# EAGLE design fx3 (EAGLE 9.6.2)
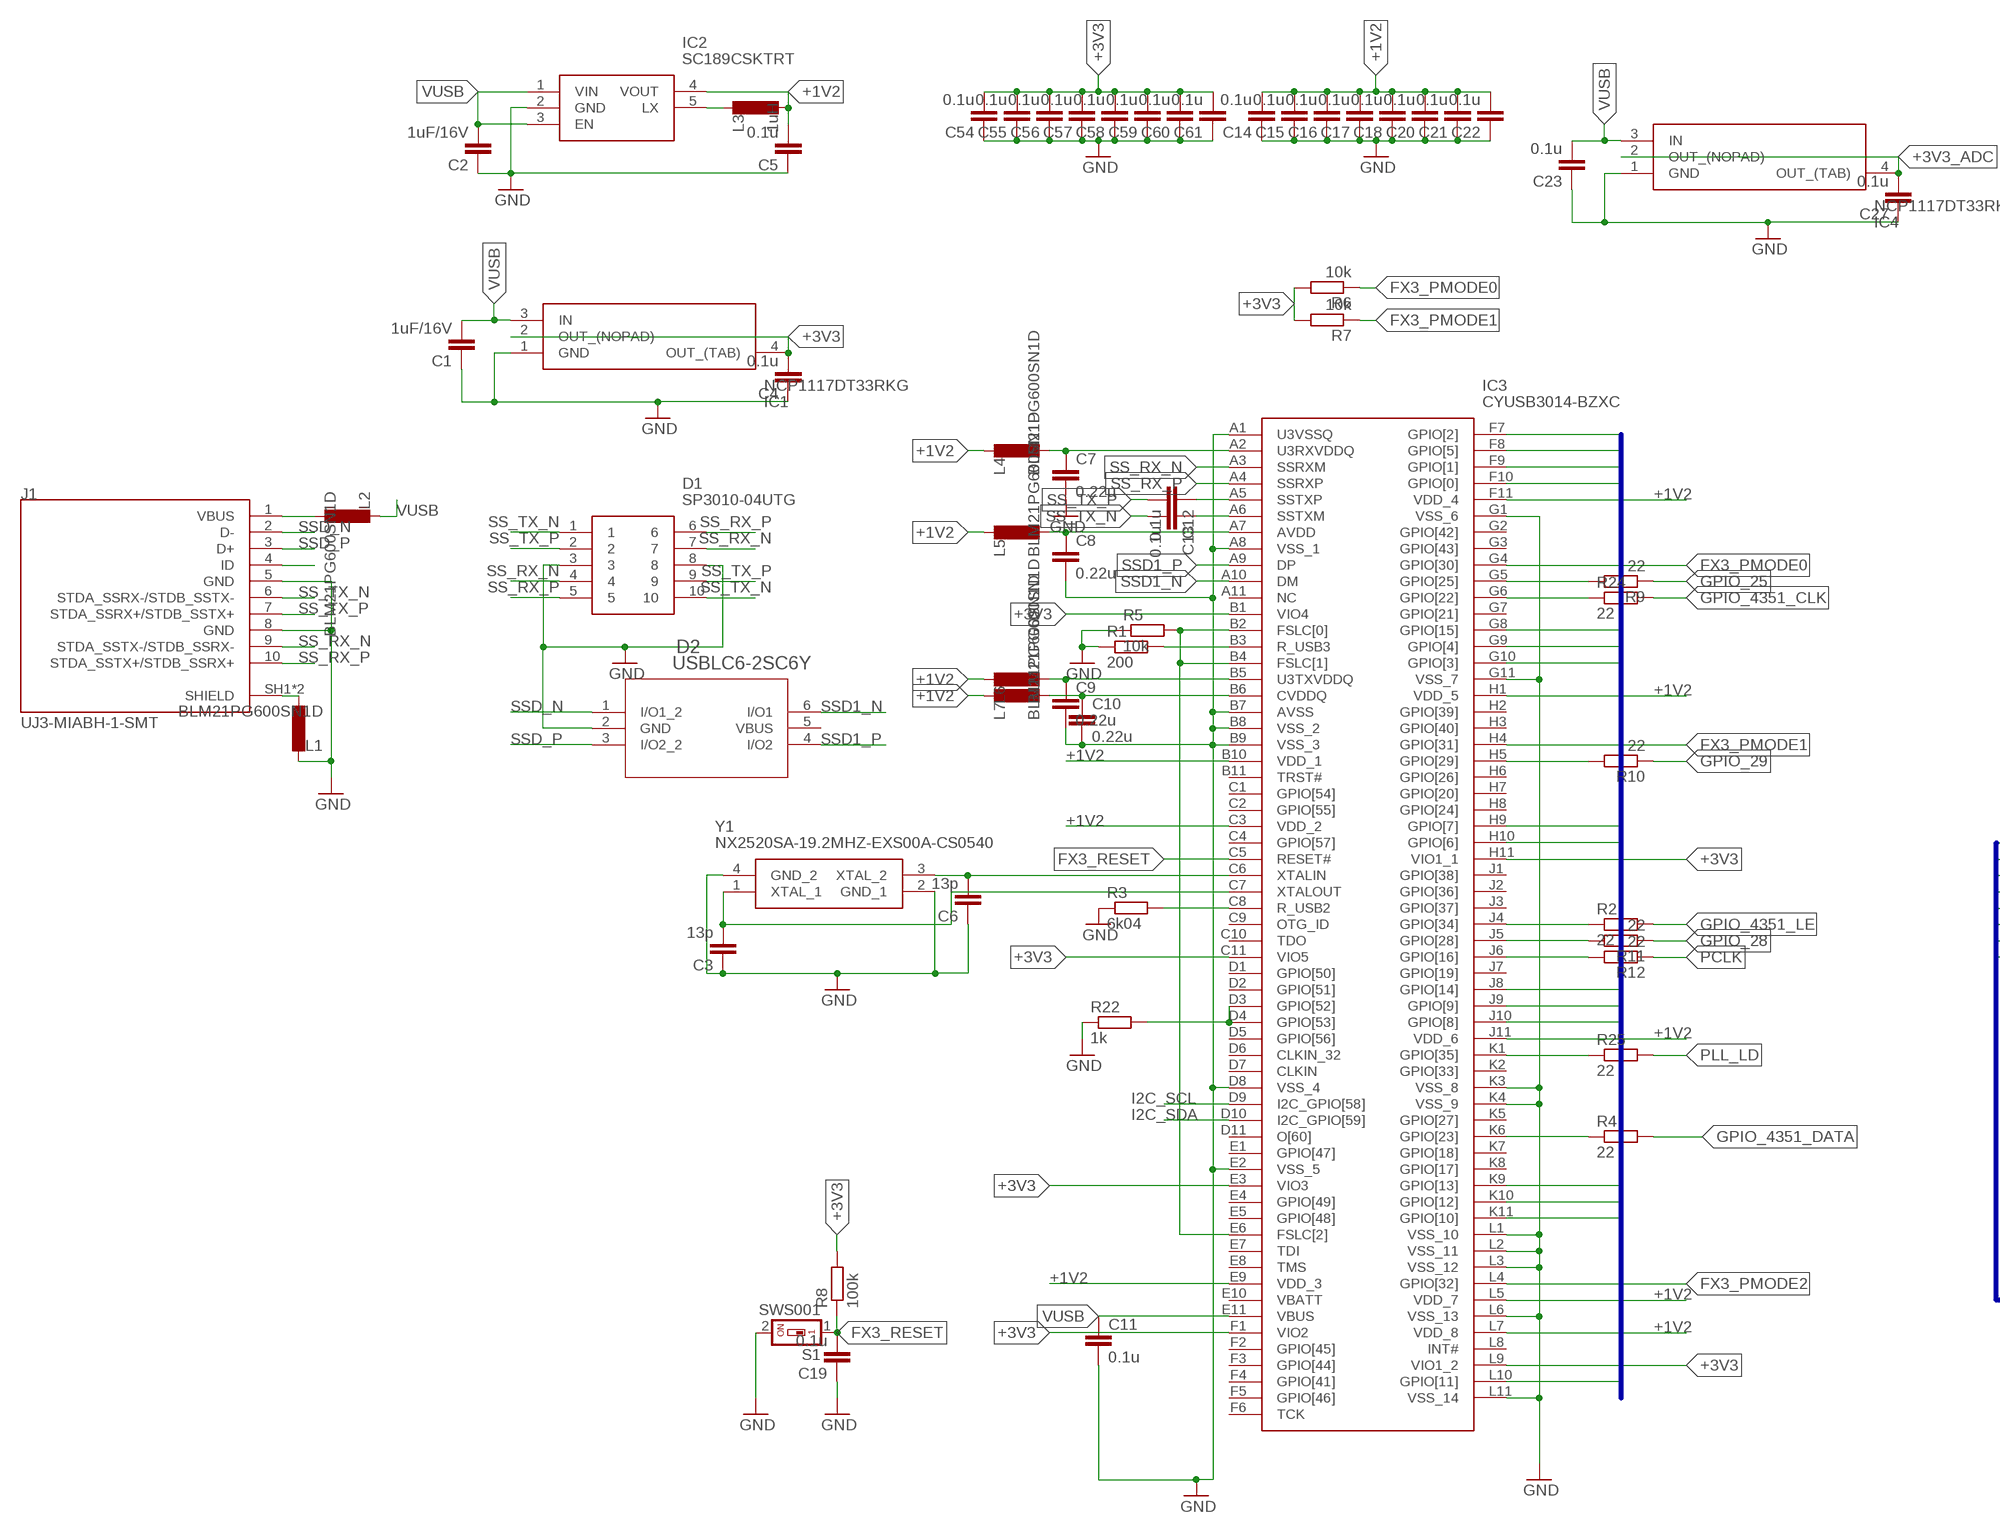
[diagram p0: schematic, sheet 1, part 1 of 2]
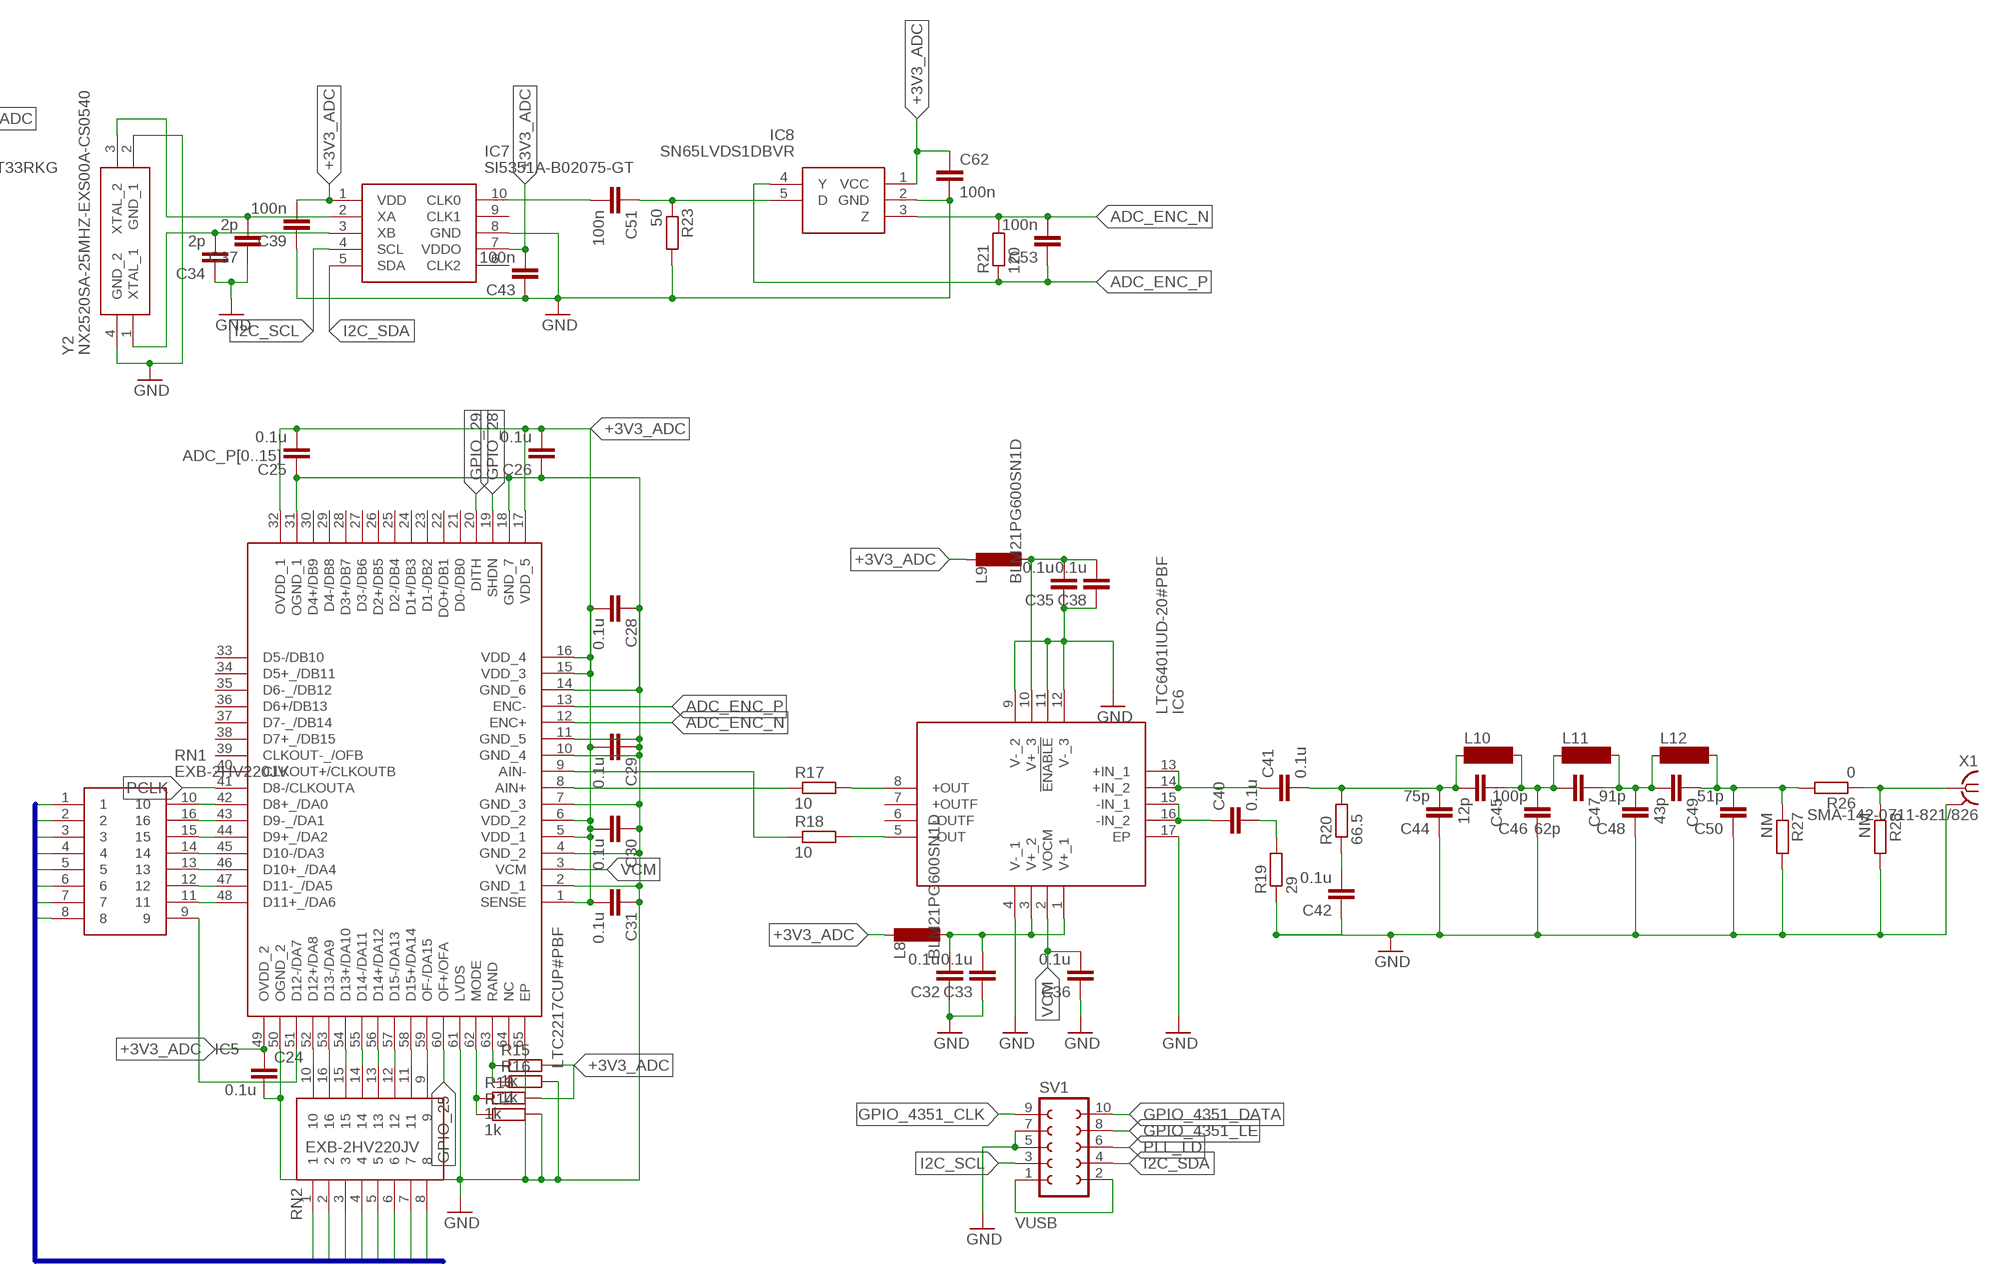
[diagram p1: schematic, sheet 1, part 2 of 2]

## Parts
C1  1uF/16V  C-EUC0603  [C0603]
C2  1uF/16V  C-EUC0603  [C0603]
C3  13p  C-EUC0603  [C0603]
C4  0.1u  C-EUC0603  [C0603]
C5  0.1u  C-EUC0603  [C0603]
C6  13p  C-EUC0603  [C0603]
C7  0.22u  C-EUC0603  [C0603]
C8  0.22u  C-EUC0603  [C0603]
C9  0.22u  C-EUC0603  [C0603]
C10  0.22u  C-EUC0603  [C0603]
C11  0.1u  C-EUC0603  [C0603]
C12  0.1u  C-EUC0603  [C0603]
C13  0.1u  C-EUC0603  [C0603]
C14  0.1u  C-EUC0603  [C0603]
C15  0.1u  C-EUC0603  [C0603]
C16  0.1u  C-EUC0603  [C0603]
C17  0.1u  C-EUC0603  [C0603]
C18  0.1u  C-EUC0603  [C0603]
C19  0.1u  C-EUC0603  [C0603]
C20  0.1u  C-EUC0603  [C0603]
C21  0.1u  C-EUC0603  [C0603]
C22  0.1u  C-EUC0603  [C0603]
C23  0.1u  C-EUC0603  [C0603]
C24  0.1u  C-EUC0603  [C0603]
C25  0.1u  C-EUC0603  [C0603]
C26  0.1u  C-EUC0603  [C0603]
C27  0.1u  C-EUC0603  [C0603]
C28  0.1u  C-EUC0603  [C0603]
C29  0.1u  C-EUC0603  [C0603]
C30  0.1u  C-EUC0603  [C0603]
C31  0.1u  C-EUC0603  [C0603]
C32  0.1u  C-EUC0603  [C0603]
C33  0.1u  C-EUC0603  [C0603]
C34  2p  C-EUC0603  [C0603]
C35  0.1u  C-EUC0603  [C0603]
C36  0.1u  C-EUC0603  [C0603]
C37  2p  C-EUC0603  [C0603]
C38  0.1u  C-EUC0603  [C0603]
C39  100n  C-EUC0603  [C0603]
C40  0.1u  C-EUC0603  [C0603]
C41  0.1u  C-EUC0603  [C0603]
C42  0.1u  C-EUC0603  [C0603]
C43  100n  C-EUC0603  [C0603]
C44  75p  C-EUC0603  [C0603]
C45  12p  C-EUC0603  [C0603]
C46  100p  C-EUC0603  [C0603]
C47  62p  C-EUC0603  [C0603]
C48  91p  C-EUC0603  [C0603]
C49  43p  C-EUC0603  [C0603]
C50  51p  C-EUC0603  [C0603]
C51  100n  C-EUC0603  [C0603]
C53  100n  C-EUC0603  [C0603]
C54  0.1u  C-EUC0603  [C0603]
C55  0.1u  C-EUC0603  [C0603]
C56  0.1u  C-EUC0603  [C0603]
C57  0.1u  C-EUC0603  [C0603]
C58  0.1u  C-EUC0603  [C0603]
C59  0.1u  C-EUC0603  [C0603]
C60  0.1u  C-EUC0603  [C0603]
C61  0.1u  C-EUC0603  [C0603]
C62  100n  C-EUC0603  [C0603]
D1  SP3010-04UTG  [UDFN-10]
D2  USBLC6-2SC6Y  [SOT23-6L_STM]
IC1  NCP1117DT33RKG  [TO229P990X238-4N]
IC2  SC189CSKTRT  [SOT95P280X145-5N]
IC3  CYUSB3014-BZXC  [BGA121C80P11X11_1000X1000X120]
IC4  NCP1117DT33RKG  [TO229P990X238-4N]
IC5  LTC2217CUP#PBF  [QFN50P900X900X80-65N]
IC6  LTC6401IUD-20#PBF  [QFN50P300X300X80-17N]
IC7  SI5351A-B02075-GT  [SOP50P490X110-10N]
IC8  SN65LVDS1DBVR  [SOT95P280X145-5N]
J1  UJ3-MIABH-1-SMT  [CUI_UJ3-MIABH-1-SMT]
L1  BLM21PG600SN1D  [BLM21AG102BH1J]
L2  BLM21PG600SN1D  [BLM21AG102BH1J]
L3  1uH  BLM21PG600SN1D  [BLM21AG102BH1J]
L4  BLM21PG600SN1D  [BLM21AG102BH1J]
L5  BLM21PG600SN1D  [BLM21AG102BH1J]
L6  BLM21PG600SN1D  [BLM21AG102BH1J]
L7  BLM21PG600SN1D  [BLM21AG102BH1J]
L8  BLM21PG600SN1D  [BLM21AG102BH1J]
L9  BLM21PG600SN1D  [BLM21AG102BH1J]
L10  MS85  [MS85]
L11  MS85  [MS85]
L12  MS85  [MS85]
R1  200  R-EU_R0603  [R0603]
R2  22  R-EU_R0603  [R0603]
R3  6k04  R-EU_R0603  [R0603]
R4  22  R-EU_R0603  [R0603]
R5  10k  R-EU_R0603  [R0603]
R6  10k  R-EU_R0603  [R0603]
R7  10k  R-EU_R0603  [R0603]
R8  100k  R-EU_R0603  [R0603]
R9  22  R-EU_R0603  [R0603]
R10  22  R-EU_R0603  [R0603]
R11  22  R-EU_R0603  [R0603]
R12  22  R-EU_R0603  [R0603]
R13  1k  R-EU_R0603  [R0603]
R14  1k  R-EU_R0603  [R0603]
R15  1k  R-EU_R0603  [R0603]
R16  1k  R-EU_R0603  [R0603]
R17  10  R-EU_R0603  [R0603]
R18  10  R-EU_R0603  [R0603]
R19  29  R-EU_R0603  [R0603]
R20  66.5  R-EU_R0603  [R0603]
R21  120  R-EU_R0603  [R0603]
R22  1k  R-EU_R0603  [R0603]
R23  50  R-EU_R0603  [R0603]
R24  22  R-EU_R0603  [R0603]
R25  22  R-EU_R0603  [R0603]
R26  0  R-EU_R0603  [R0603]
R27  NM  R-EU_R0603  [R0603]
R28  NM  R-EU_R0603  [R0603]
RN1  EXB-2HV220JV  [EXB2HV220JV]
RN2  EXB-2HV220JV  [EXB2HV220JV]
S1  SWS001  [SMS-001]
SV1  FE05-2  [FE05-2]
X1  SMA-142-0711-821/826  [J502-ND-142-0711-821/826]
Y1  NX2520SA-19.2MHZ-EXS00A-CS0540  [NX2520SA192MHZEXS00ACS05400]
Y2  NX2520SA-25MHZ-EXS00A-CS0540  NX2520SA-19.2MHZ-EXS00A-CS0540  [NX2520SA192MHZEXS00ACS05400]

## Nets
+1V2: C5.2 C14.2 C15.2 C16.2 C17.2 C18.2 C20.2 C21.2 C22.2 IC2.4(VOUT) IC3.B10(VDD_1) IC3.C3(VDD_2) IC3.E9(VDD_3) IC3.F11(VDD_4) IC3.H1(VDD_5) IC3.J11(VDD_6) IC3.L5(VDD_7) IC3.L7(VDD_8) L3.2 L4.1 L5.1 L6.1 L7.1
+3V3: C4.2 C54.2 C55.2 C56.2 C57.2 C58.2 C59.2 C60.2 C61.2 IC1.2(OUT_(NOPAD)) IC1.4(OUT_(TAB)) IC3.B1(VIO4) IC3.C11(VIO5) IC3.E3(VIO3) IC3.F1(VIO2) IC3.H11(VIO1_1) IC3.L9(VIO1_2) R6.2 R7.2 R8.2
+3V3_ADC: C24.1 C25.2 C26.2 C27.2 C28.2 C29.2 C30.2 C31.2 C39.2 C43.2 C62.1 IC4.2(OUT_(NOPAD)) IC4.4(OUT_(TAB)) IC5.1(SENSE) IC5.5(VDD_1) IC5.6(VDD_2) IC5.15(VDD_3) IC5.16(VDD_4) IC5.17(VDD_5) IC5.32(OVDD_1) IC5.49(OVDD_2) IC7.1(VDD) IC7.7(VDDO) IC8.1(VCC) L8.1 L9.1 R13.2 R15.2
ADC_ENC_N: C53.2 IC5.12(ENC+) IC8.3(Z) R21.2
ADC_ENC_P: C53.1 IC5.13(ENC-) IC8.4(Y) R21.1
ADC_P0: IC3.F10(GPIO[0]) RN1.1
ADC_P1: IC3.F9(GPIO[1]) RN1.2
ADC_P2: IC3.F7(GPIO[2]) RN1.3
ADC_P3: IC3.G10(GPIO[3]) RN1.4
ADC_P4: IC3.G9(GPIO[4]) RN1.5
ADC_P5: IC3.F8(GPIO[5]) RN1.6
ADC_P6: IC3.H10(GPIO[6]) RN1.7
ADC_P7: IC3.H9(GPIO[7]) RN1.8
ADC_P8: IC3.J10(GPIO[8]) RN2.1
ADC_P9: IC3.J9(GPIO[9]) RN2.2
ADC_P10: IC3.K11(GPIO[10]) RN2.3
ADC_P11: IC3.L10(GPIO[11]) RN2.4
ADC_P12: IC3.K10(GPIO[12]) RN2.5
ADC_P13: IC3.K9(GPIO[13]) RN2.6
ADC_P14: IC3.J8(GPIO[14]) RN2.7
ADC_P15: IC3.G8(GPIO[15]) RN2.8
AVDD_A7: C8.1 IC3.A7(AVDD) L5.2
CVDDQ_B6: C10.1 IC3.B6(CVDDQ) L7.2
FX3_PMODE0: IC3.G4(GPIO[30]) R6.1
FX3_PMODE1: IC3.H4(GPIO[31]) R7.1
FX3_PMODE2: IC3.L4(GPIO[32])
FX3_RESET: C19.2 IC3.C5(RESET#) R8.1 S1.1
GND: C1.1 C2.1 C3.1 C4.1 C5.1 C6.1 C7.2 C8.2 C9.2 C10.2 C11.2 C14.1 C15.1 C16.1 C17.1 C18.1 C19.1 C20.1 C21.1 C22.1 C23.1 C24.2 C25.1 C26.1 C27.1 C28.1 C29.1 C30.1 C31.1 C32.1 C33.1 C34.1 C35.1 C36.1 C37.1 C38.1 C39.1 C42.1 C43.1 C44.1 C46.1 C48.1 C50.1 C54.1 C55.1 C56.1 C57.1 C58.1 C59.1 C60.1 C61.1 C62.2 D1.3 D1.8 D2.2(GND) IC1.1(GND) IC2.2(GND) IC3.A1(U3VSSQ) IC3.A8(VSS_1) IC3.B7(AVSS) IC3.B8(VSS_2) IC3.B9(VSS_3) IC3.D8(VSS_4) IC3.E2(VSS_5) IC3.G1(VSS_6) IC3.G11(VSS_7) IC3.K3(VSS_8) IC3.K4(VSS_9) IC3.L1(VSS_10) IC3.L2(VSS_11) IC3.L3(VSS_12) IC3.L6(VSS_13) IC3.L11(VSS_14) IC4.1(GND) IC5.2(GND_1) IC5.4(GND_2) IC5.7(GND_3) IC5.10(GND_4) IC5.11(GND_5) IC5.14(GND_6) IC5.18(GND_7) IC5.31(OGND_1) IC5.50(OGND_2) IC5.61(LVDS) IC5.65(EP) IC6.4(V-_1) IC6.9(V-_2) IC6.11(!ENABLE) IC6.12(V-_3) IC6.17(EP) IC7.8(GND) IC8.2(GND) J1.5(GND) J1.8(GND) L1.1 R1.1 R3.1 R5.1 R14.2 R16.2 R19.1 R22.1 R23.2 R27.2 R28.2 S1.2 SV1.5 SV1.7 X1.G@1 X1.G@2 X1.G@3 X1.G@4 Y1.2(GND_1) Y1.4(GND_2) Y2.2(GND_1) Y2.4(GND_2)
GPIO_25: IC5.60(OF+/OFA) R9.1
GPIO_28: IC5.19(SHDN) R11.1
GPIO_29: IC5.20(DITH) R10.1
GPIO_4351_CLK: R24.2 SV1.9
GPIO_4351_DATA: R4.2 SV1.10
GPIO_4351_LE: R2.2 SV1.8
I2C_SCL: IC3.D9(I2C_GPIO[58]) IC7.4(SCL) SV1.3
I2C_SDA: IC3.D10(I2C_GPIO[59]) IC7.5(SDA) SV1.4
N$1 [RF]: C40.1 IC6.15(-IN_1) IC6.16(-IN_2)
N$2 [RF]: C47.1 C48.2 C49.2 L11.2 L12.1
N$3 [RF]: C41.1 IC6.13(+IN_1) IC6.14(+IN_2)
N$4 [RF]: C40.2 R19.2
N$5 [RF]: C41.2 C44.2 C45.2 L10.1 R20.2
N$6 [RF]: C42.2 R20.1
N$7: IC6.5(-OUT) R18.2
N$8: IC6.8(+OUT) R17.2
N$9: IC5.8(AIN+) R17.1
N$10: IC5.9(AIN-) R18.1
N$11: IC3.K6(GPIO[23]) R4.1
N$12 [RF]: C49.1 C50.2 L12.2 R26.2 R27.1
N$13 [RF]: C45.1 C46.2 C47.2 L10.2 L11.1
N$14: C37.2 IC7.2(XA) Y2.3(XTAL_2)
N$15: C6.2 IC3.C6(XTALIN) Y1.3(XTAL_2)
N$16: C3.2 IC3.C7(XTALOUT) Y1.1(XTAL_1)
N$17: IC3.J4(GPIO[34]) R2.1
N$18: IC5.59(OF-/DA15) RN2.9
N$19: IC5.51(D12-/DA7) RN1.9
N$20: IC5.52(D12+/DA8) RN2.10
N$21: IC5.53(D13-/DA9) RN2.16
N$22: IC5.54(D13+/DA10) RN2.15
N$23: IC5.55(D14-/DA11) RN2.14
N$24: IC5.56(D14+/DA12) RN2.13
N$25: IC5.57(D15-/DA13) RN2.12
N$26: IC5.58(D15+/DA14) RN2.11
N$27: IC5.48(D11+_/DA6) RN1.11
N$28: IC5.47(D11-_/DA5) RN1.12
N$29: IC5.46(D10+_/DA4) RN1.13
N$30: IC5.45(D10-/DA3) RN1.14
N$31: IC5.44(D9+_/DA2) RN1.15
N$32: IC5.43(D9-_/DA1) RN1.16
N$33: IC5.42(D8+_/DA0) RN1.10
N$34: IC5.62(MODE) R13.1 R14.1
N$35: IC3.H5(GPIO[29]) R10.2
N$36: IC5.63(RAND) R15.1 R16.1
N$37: IC3.J6(GPIO[16]) R12.2
N$38: IC3.J5(GPIO[28]) R11.2
N$39: IC3.G5(GPIO[25]) R9.2
N$40: J1.SH1(SHIELD) J1.SH2(SHIELD) L1.2
N$41: J1.4(ID)
N$42: J1.1(VBUS) L2.2
N$43: C51.2 IC7.10(CLK0)
N$44: C51.1 IC8.5(D) R23.1
N$45: IC3.D3(GPIO[52]) IC3.D4(GPIO[53]) R22.2
N$46: IC3.G6(GPIO[22]) R24.1
N$47: C13.1 IC3.A6(SSTXM)
N$48: C12.1 IC3.A5(SSTXP)
N$49: IC3.B2(FSLC[0]) IC3.B4(FSLC[1]) IC3.E6(FSLC[2]) R5.2
N$50: IC3.C8(R_USB2) R3.2
N$51: IC3.B3(R_USB3) R1.2
N$52: C34.2 IC7.3(XB) Y2.1(XTAL_1)
N$53: IC3.K1(GPIO[35]) R25.1
N$54: IC2.5(LX) L3.1
N$57 [RF]: R26.1 R28.1 X1.1
PCLK: IC5.41(D8-/CLKOUTA) R12.1
PLL_LD: R25.2 SV1.6
SS_RX_N: D1.4 D1.7 IC3.A3(SSRXM) J1.9(STDA_SSTX-/STDB_SSRX-)
SS_RX_P: D1.5 D1.6 IC3.A4(SSRXP) J1.10(STDA_SSTX+/STDB_SSRX+)
SS_TX_N: C13.2 D1.1 D1.10 J1.6(STDA_SSRX-/STDB_SSTX-)
SS_TX_P: C12.2 D1.2 D1.9 J1.7(STDA_SSRX+/STDB_SSTX+)
SSD1_N: D2.6(I/O1) IC3.A10(DM)
SSD1_P: D2.4(I/O2) IC3.A9(DP)
SSD_N: D2.1(I/O1_2) J1.2(D-)
SSD_P: D2.3(I/O2_2) J1.3(D+)
U3RXV_A2: C7.1 IC3.A2(U3RXVDDQ) L4.2
U3TXVDDQ_B5: C9.1 IC3.B5(U3TXVDDQ) L6.2
VCM: C36.2 IC5.3(VCM) IC6.2(VOCM)
VPROR: C32.2 C33.2 C35.2 C38.2 IC6.1(V+_1) IC6.3(V+_2) IC6.10(V+_3) L8.2 L9.2
VUSB: C1.2 C2.2 C11.1 C23.2 IC1.3(IN) IC2.1(VIN) IC2.3(EN) IC3.E11(VBUS) IC4.3(IN) L2.1 SV1.1 SV1.2
Unconnected: IC3.A11(NC) IC3.B11(TRST#) IC3.C1(GPIO[54]) IC3.C2(GPIO[55]) IC3.C4(GPIO[57]) IC3.C9(OTG_ID) IC3.C10(TDO) IC3.D1(GPIO[50]) IC3.D2(GPIO[51]) IC3.D5(GPIO[56]) IC3.D6(CLKIN_32) IC3.D7(CLKIN) IC3.D11(O[60]) IC3.E1(GPIO[47]) IC3.E4(GPIO[49]) IC3.E5(GPIO[48]) IC3.E7(TDI) IC3.E8(TMS) IC3.E10(VBATT) IC3.F2(GPIO[45]) IC3.F3(GPIO[44]) IC3.F4(GPIO[41]) IC3.F5(GPIO[46]) IC3.F6(TCK) IC3.G2(GPIO[42]) IC3.G3(GPIO[43]) IC3.G7(GPIO[21]) IC3.H2(GPIO[39]) IC3.H3(GPIO[40]) IC3.H6(GPIO[26]) IC3.H7(GPIO[20]) IC3.H8(GPIO[24]) IC3.J1(GPIO[38]) IC3.J2(GPIO[36]) IC3.J3(GPIO[37]) IC3.J7(GPIO[19]) IC3.K2(GPIO[33]) IC3.K5(GPIO[27]) IC3.K7(GPIO[18]) IC3.K8(GPIO[17]) IC3.L8(INT#) IC5.21(D0-/DB0) IC5.22(DO+/DB1) IC5.23(D1-/DB2) IC5.24(D1+/DB3) IC5.25(D2-/DB4) IC5.26(D2+/DB5) IC5.27(D3-/DB6) IC5.28(D3+/DB7) IC5.29(D4-/DB8) IC5.30(D4+/DB9) IC5.33(D5-/DB10) IC5.34(D5+_/DB11) IC5.35(D6-_/DB12) IC5.36(D6+/DB13) IC5.37(D7-_/DB14) IC5.38(D7+_/DB15) IC5.39(CLKOUT-_/OFB) IC5.40(CLKOUT+/CLKOUTB) IC5.64(NC) IC6.6(-OUTF) IC6.7(+OUTF) IC7.6(CLK2) IC7.9(CLK1)

## Buses
ADC_P[0..15]

## Power pins joined to a net without a drawn wire
VBUS: D2.5(VBUS)

## Library data of the parts
C1-C51 C53-C62 = rcl:C-EU: CAPACITOR, European symbol; SPICEPREFIX: C
D1 = SamacSys_Parts:SP3010-04UTG: TVS Diode Arrays (SPA Diodes) Low Capacitance ESD Protection - SP3010 Series Source: Datasheet <http://www.littelfuse.com/~/media/electronics/datasheets/tvs_diode_arrays/littelfuse_tvs_diode_array_sp3010_datasheet.pdf.pdf>; DESCRIPTION: TVS Diode Arrays (SPA Diodes) Low Capacitance ESD Protection - SP3010 Series; HEIGHT: mm; MANUFACTURER_NAME: LITTELFUSE; MANUFACTURER_PART_NUMBER: SP3010-04UTG; MOUSER_PART_NUMBER: 576-SP3010-04UTG; MOUSER_PRICE-STOCK: https://www.mouser.co.uk/ProductDetail/Littelfuse/SP3010-04UTG?qs=KdxuMbIzuPD29pCwLY5YGg%3D%3D
D2 = USBLC6:USBLC6-2SC6Y; BUILT_BY: EMA_UL_Team; MANUFACTURER_PART_NUMBER: USBLC6-2SC6Y; SOURCELIBRARY: Update_to_database_2020-12-04; VENDOR: STMicroelectronics
IC1 IC4 = SamacSys_Parts:NCP1117DT33RKG: ON SEMICONDUCTOR - NCP1117DT33RKG - IC, LINEAR VOLTAGE REGULATOR Source: Datasheet <http://www.onsemi.com/pub/Collateral/NCP1117-D.PDF>; DESCRIPTION: ON SEMICONDUCTOR - NCP1117DT33RKG - IC, LINEAR VOLTAGE REGULATOR; HEIGHT: 2.38mm; MANUFACTURER_NAME: ON Semiconductor; MANUFACTURER_PART_NUMBER: NCP1117DT33RKG; MOUSER_PART_NUMBER: 863-NCP1117DT33RKG; MOUSER_PRICE-STOCK: https://www.mouser.co.uk/ProductDetail/ON-Semiconductor/NCP1117DT33RKG?qs=Gev%252BmEvV0ibOCOlPKZVI0Q%3D%3D
IC2 = SamacSys_Parts:SC189CSKTRT: Conv DC-DC 2.9V to 5.5V Synchronous Step Down Single-Out 1.2V 1.5A 6-Pin MLPD-UT T/R Source: Datasheet <https://www.semtech.com/uploads/documents/sc189.pdf>; DESCRIPTION: Conv DC-DC 2.9V to 5.5V Synchronous Step Down Single-Out 1.2V 1.5A 6-Pin MLPD-UT T/R; HEIGHT: 1.45mm; MANUFACTURER_NAME: SEMTECH; MANUFACTURER_PART_NUMBER: SC189CSKTRT; MOUSER_PART_NUMBER: 947-SC189CSKTRT; MOUSER_PRICE-STOCK: https://www.mouser.co.uk/ProductDetail/Semtech/SC189CSKTRT?qs=rBWM4%252BvDhIcKNVCFfiXT%2Fw%3D%3D
IC3 = SamacSys_Parts:CYUSB3014-BZXC: CYPRESS SEMICONDUCTOR - CYUSB3014-BZXC. - TRAY / USB SuperSpeed Peripherals 54W7901 Source: Datasheet <http://www.cypress.com/file/140296/download>; DESCRIPTION: CYPRESS SEMICONDUCTOR - CYUSB3014-BZXC. - TRAY / USB SuperSpeed Peripherals 54W7901; HEIGHT: 1.2mm; MANUFACTURER_NAME: Cypress Semiconductor; MANUFACTURER_PART_NUMBER: CYUSB3014-BZXC; MOUSER_PART_NUMBER: 727-CYUSB3014-BZXC; MOUSER_PRICE-STOCK: https://www.mouser.co.uk/ProductDetail/Cypress-Semiconductor/CYUSB3014-BZXC?qs=xP2cAaN2A3Wt%252BQariFLwRg%3D%3D
IC5 = SamacSys_Parts:LTC2217CUP#PBF: Analog to Digital Converters - ADC 16-bit, 105Msps Low Noise ADC Source: Datasheet <https://www.analog.com/media/en/technical-documentation/data-sheets/2217f.pdf>; DESCRIPTION: Analog to Digital Converters - ADC 16-bit, 105Msps Low Noise ADC; HEIGHT: 0.8mm; MANUFACTURER_NAME: Analog Devices; MANUFACTURER_PART_NUMBER: LTC2217CUP#PBF
IC6 = SamacSys_Parts:LTC6401IUD-20#PBF: High Speed Operational Amplifiers 3GHz Low Noise/Low Distortion Differential Amp Source: Datasheet <https://componentsearchengine.com/Datasheets/1/LTC6401IUD-20#PBF.pdf>; DESCRIPTION: High Speed Operational Amplifiers 3GHz Low Noise/Low Distortion Differential Amp; HEIGHT: 0.8mm; MANUFACTURER_NAME: Analog Devices; MANUFACTURER_PART_NUMBER: LTC6401IUD-20#PBF; MOUSER_PART_NUMBER: 584-LTC6401IUD-20PBF; MOUSER_PRICE-STOCK: https://www.mouser.com/Search/Refine.aspx?Keyword=584-LTC6401IUD-20PBF
IC7 = SamacSys_Parts:SI5351A-B02075-GT: Clock Generators & Support Products I2C Prog, Any Frequency, Any Output, Xtal Ref, 3-Output LVCMOS Clock Gen Source: Datasheet; DESCRIPTION: Clock Generators & Support Products I2C Prog, Any Frequency, Any Output, Xtal Ref, 3-Output LVCMOS Clock Gen; HEIGHT: 1.1mm; MANUFACTURER_NAME: Silicon Labs; MANUFACTURER_PART_NUMBER: Si5351A-B02075-GT; MOUSER_PART_NUMBER: 634-SI5351A-B02075GT; MOUSER_PRICE-STOCK: https://www.mouser.co.uk/ProductDetail/Silicon-Labs/SI5351A-B02075-GT?qs=p9T7GgSe1IHt8ib3k5KY5Q%3D%3D
IC8 = SamacSys_Parts:SN65LVDS1DBVR: SN65LVDS1DBVR, LVDS Transmitter LVTTL Driver, Receiver 630Mbit/s, 2.4 ??? 3.6 V, 5-Pin, SOT-23 Source: Datasheet <http://www.ti.com/lit/ds/symlink/sn65lvds1.pdf>; DESCRIPTION: SN65LVDS1DBVR, LVDS Transmitter LVTTL Driver, Receiver 630Mbit/s, 2.4 ??? 3.6 V, 5-Pin, SOT-23; HEIGHT: 1.45mm; MANUFACTURER_NAME: Texas Instruments; MANUFACTURER_PART_NUMBER: SN65LVDS1DBVR; MOUSER_PART_NUMBER: 595-SN65LVDS1DBVR; MOUSER_PRICE-STOCK: https://www.mouser.co.uk/ProductDetail/Texas-Instruments/SN65LVDS1DBVR?qs=X1HXWTtiZ0SZLUdr5FQ%2F7g%3D%3D
J1 = UJ3-MIABH-1-SMT:UJ3-MIABH-1-SMT: Micro AB, USB 3.0/3.1 Gen 1, 1.8 A, Right Angle, Surface Mount (SMT), USB Receptacle; AVAILABILITY: Unavailable; CUI_PURCHASE_URL: https://www.cui.com/product/interconnect/usb-connectors/micro-ab/uj3-miabh-1-smt?utm_source=snapeda.com&utm_medium=referral&utm_campaign=snapedaBOM; DESCRIPTION: Micro AB Type 10 Pin Horizontal 3 µin Plating SMT USB Jack 3.0; MF: CUI Inc.; MP: UJ3-MIABH-1-SMT-TR; PACKAGE: None; PRICE: None
L1-L9 = SamacSys_Parts:BLM21PG600SN1D: Murata Ferrite Bead (Chip Ferrite Bead), 2 x 1.25 x 0.85mm (805), 60 impedance at 100 MHz Source: Datasheet <https://www.murata.com/en-us/products/productdetail?partno=BLM21PG600SN1#>; DESCRIPTION: Murata Ferrite Bead (Chip Ferrite Bead), 2 x 1.25 x 0.85mm (805), 60 impedance at 100 MHz; HEIGHT: 1.05mm; MANUFACTURER_NAME: Murata Electronics; MANUFACTURER_PART_NUMBER: BLM21PG600SN1D; MOUSER_PART_NUMBER: 81-BLM21P600S; MOUSER_PRICE-STOCK: https://www.mouser.co.uk/ProductDetail/Murata-Electronics/BLM21PG600SN1D?qs=LbqjZSvnDswFXSg06XQ50A%3D%3D
L10-L12 = inductor-neosid:MS85: INDUCTOR SMD power inductor; OC_FARNELL: unknown; OC_NEWARK: unknown
R1-R28 = rcl:R-EU_: RESISTOR, European symbol; SPICEPREFIX: R
RN1 RN2 = SamacSys_Parts:EXB-2HV220JV: Resistor Networks & Arrays 22 OHM 5% Source: Datasheet <https://industrial.panasonic.com/cdbs/www-data/pdf/AOC0000/AOC0000C14.pdf>; DESCRIPTION: Resistor Networks & Arrays 22 OHM 5%; HEIGHT: 0.55mm; MANUFACTURER_NAME: Panasonic; MANUFACTURER_PART_NUMBER: EXB-2HV220JV; MOUSER_PART_NUMBER: 667-EXB-2HV220JV; MOUSER_PRICE-STOCK: https://www.mouser.co.uk/ProductDetail/Panasonic/EXB-2HV220JV?qs=X77odr8wTcHgD0kDWOSHpg%3D%3D
S1 = smd-special:SWS001: SMD Dip Switch 1 pol.
SV1 = con-lsta:FE05-2: FEMALE HEADER; OC_FARNELL: unknown; OC_NEWARK: unknown
X1 = con-coax:SMA-: SMA 50 Ohm End Launch Jack Receptacle - Round Contact Johnson Components Source: www.johnsoncomponents.com .. J502-ND.pdf; MF: JOHNSON COMPONENTS; MPN: 142-0711-821; OC_FARNELL: 1019328; OC_NEWARK: 16F3627
Y1 Y2 = SamacSys_Parts:NX2520SA-19.2MHZ-EXS00A-CS0540: Crystals CRYSTAL 19.2MHZ 13PF SMD Source: Datasheet; DESCRIPTION: Crystals CRYSTAL 19.2MHZ 13PF SMD; HEIGHT: 0.55mm; MANUFACTURER_NAME: NDK; MANUFACTURER_PART_NUMBER: NX2520SA-19.2MHz-EXS00A-CS05400; MOUSER_PART_NUMBER: 344-NX2520SA19.2MH54; MOUSER_PRICE-STOCK: https://www.mouser.co.uk/ProductDetail/NDK/NX2520SA-192MHz-EXS00A-CS05400?qs=w%2Fv1CP2dgqrhlY9DOqRjEQ%3D%3D

## Net classes
1 RF: clearance 0.381 mm

## Board
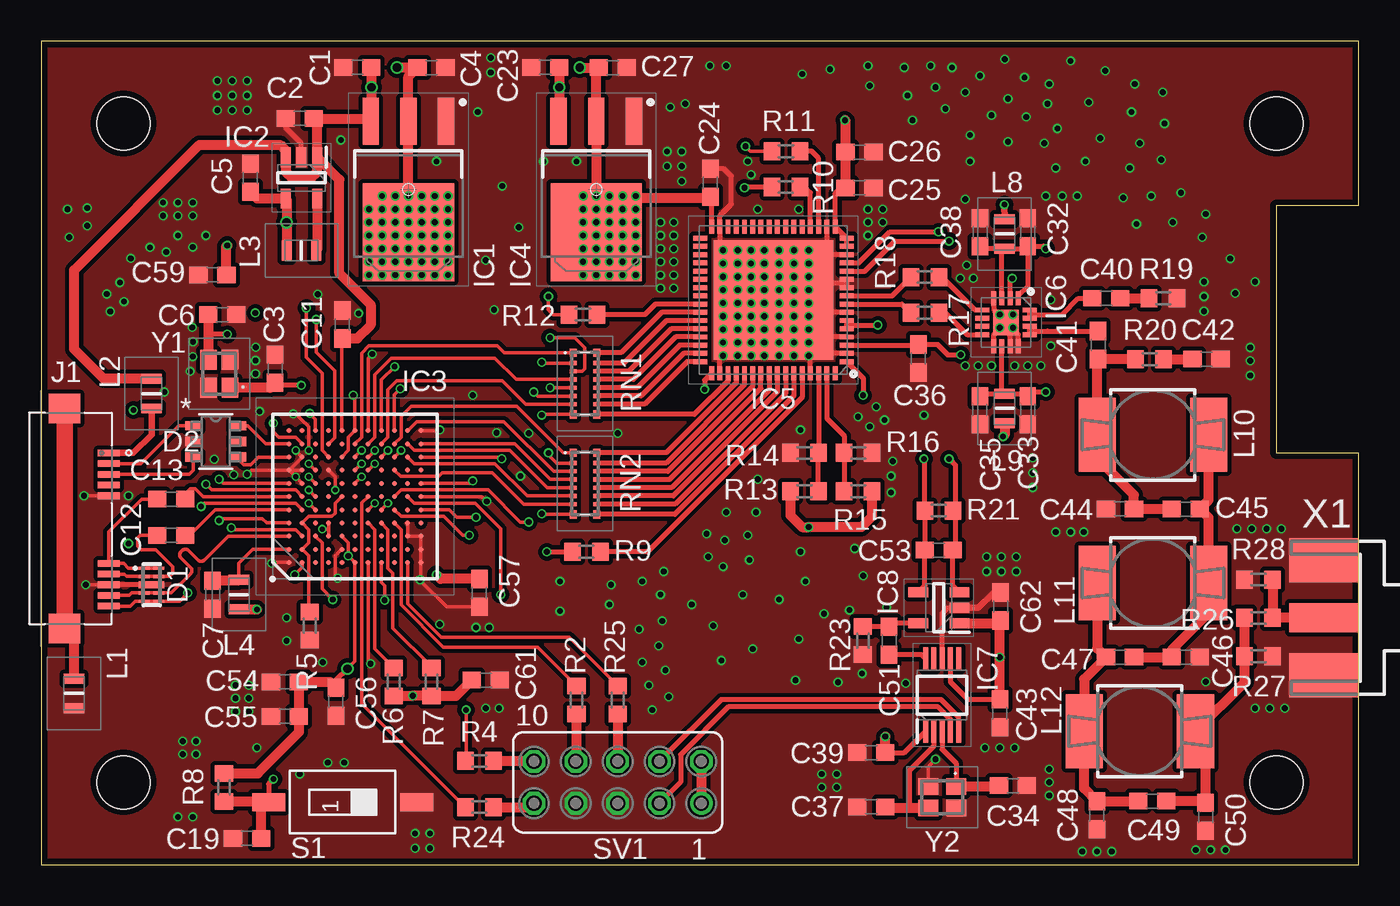
[diagram p2: board, top side]
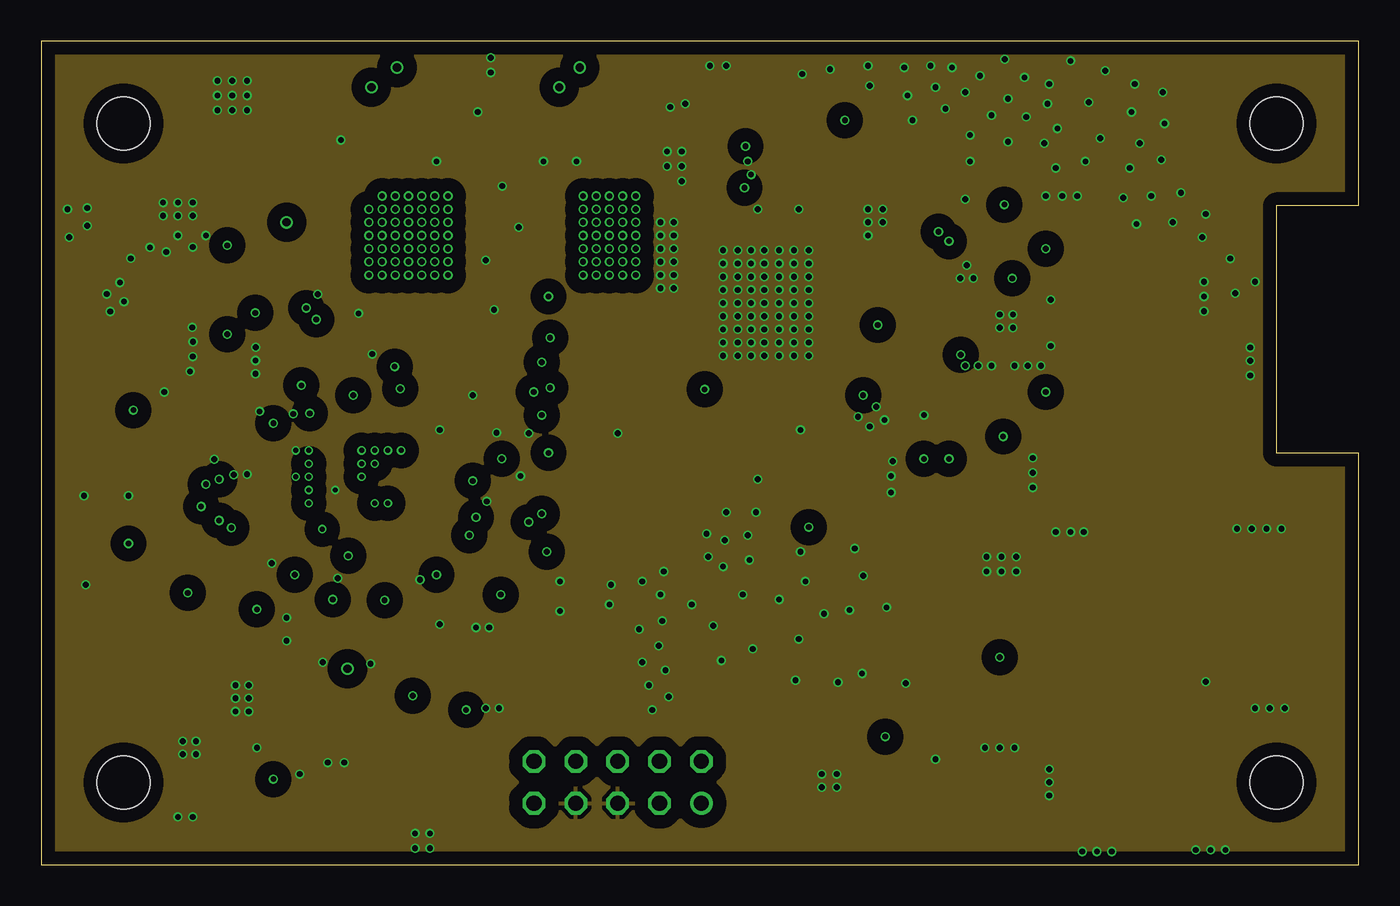
[diagram p3: board, inner layer Route2]
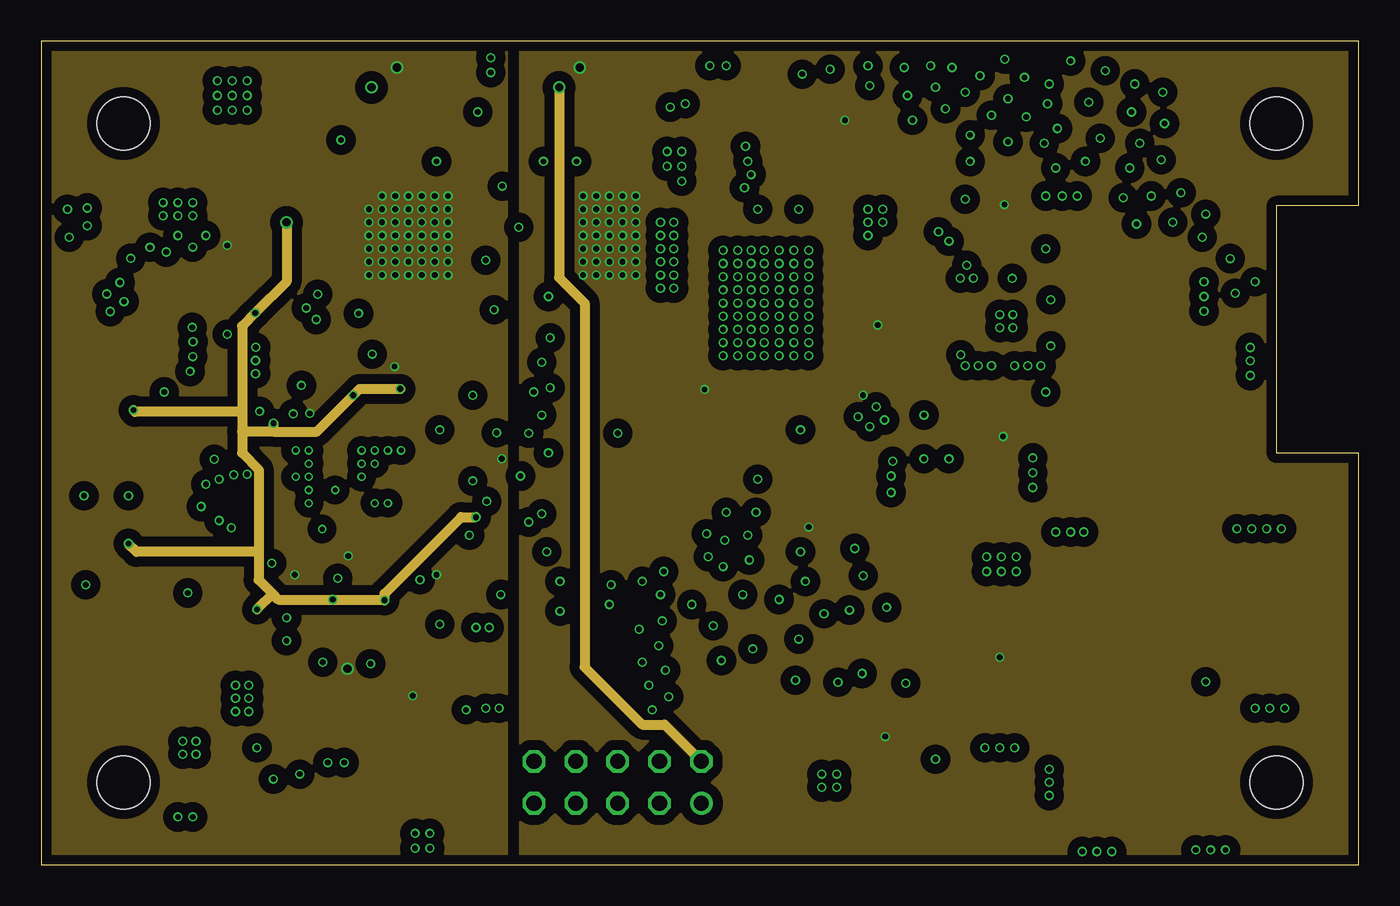
[diagram p4: board, inner layer Route15]
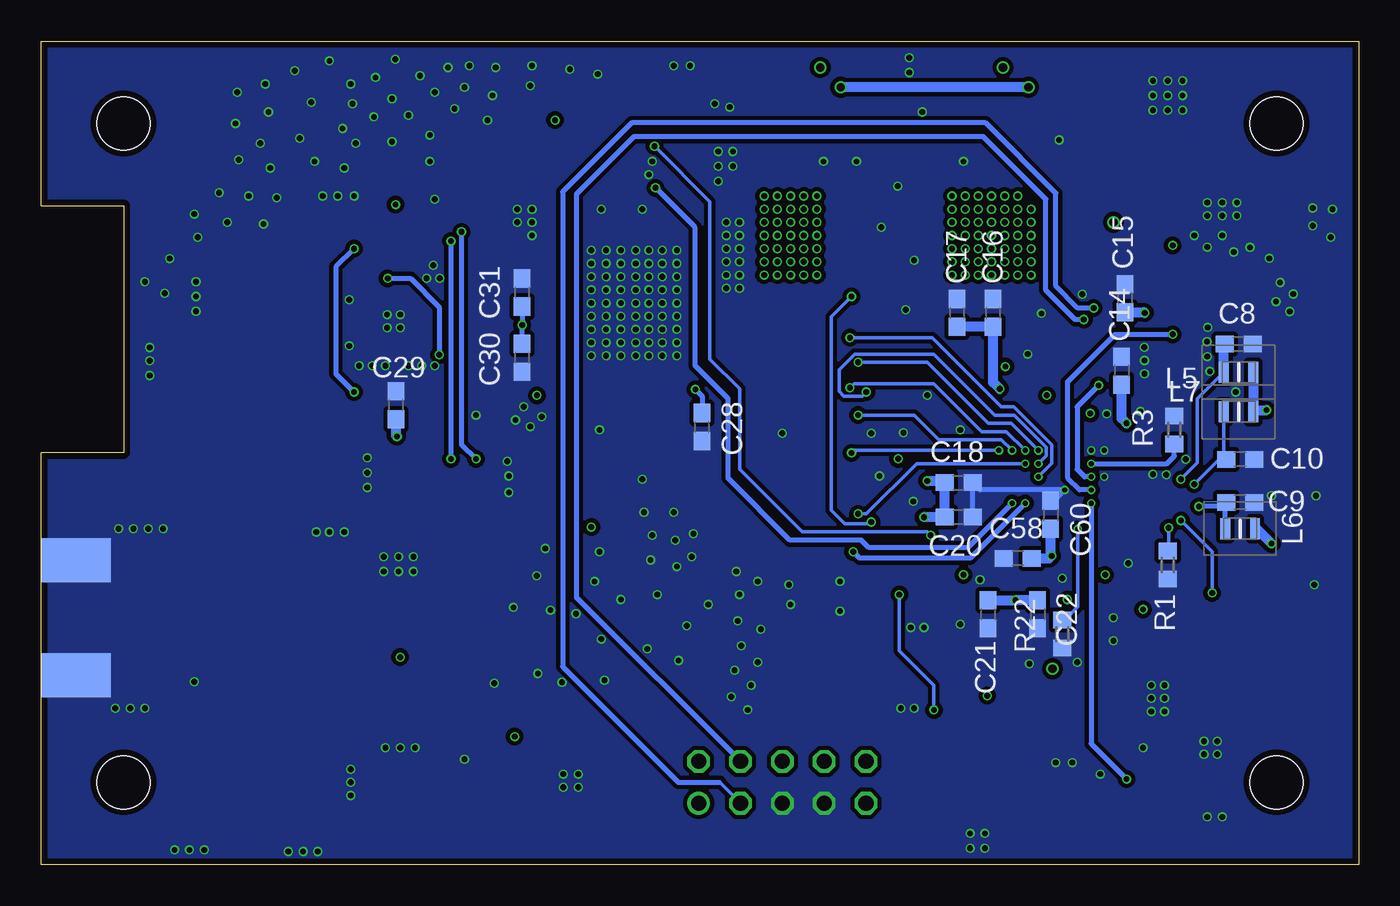
[diagram p5: board, bottom side, seen from below]

Size 80 x 50 mm. Coordinates in mm from the lower left corner, seen from the top.
Outline: 0,0 80,0 80,25 75,25 75,40 80,40 80,50 0,50 0,0
Copper layers (1*2*15*16): Top 0.035559375mm / dielectric 0.17018125mm / Route2 0.01778125mm / dielectric 47mil / Route15 0.01778125mm / dielectric 0.17018125mm / Bottom 0.035559375mm
Design rules "oshpark-4layer *": minimum track width 5mil, minimum drill 10mil, track to track 5mil, track to pad 5mil, pad to pad 5mil, via to via 5mil, smd to smd 5mil, copper to edge 15mil, drill to drill 6mil, minimum pad ring 4mil, minimum via ring 4mil, stop-mask expansion 1.5mil, vias tented up to drill 0.35mm, thermal gap 10mil
Holes 3.2 mm at 5,5 5,45 75,5 75,45

### Footprints (pad centres in the part's own frame; a part is rotated, then mirrored left to right if it is on the bottom)
C0603 = smd 1.1 x 1: 1 -0.85,0; 2 0.85,0
UDFN-10 = smd 0.2 x 0.675: 1 -1,-0.438; 2 -0.5,-0.438; 4 0.5,-0.438; 5 1,-0.438; 6 1,0.438; 7 0.5,0.438; 9 -0.5,0.438; 10 -1,0.438 | smd 0.4 x 0.775: 3 0,-0.388; 8 0,0.388
SOT23-6L_STM = smd 0.978 x 0.559: 1 -1.365,0.95; 2 -1.365,0; 3 -1.365,-0.95; 4 1.365,-0.95; 5 1.365,0; 6 1.365,0.95
TO229P990X238-4N = smd 2.85 x 1: 1 -4.15,2.29; 2 -4.15,0; 3 -4.15,-2.29 | smd 5.95 x 5.55: 4 2.6,0
SOT95P280X145-5N = smd 1.2 x 0.6: 1 -1.25,0.95; 2 -1.25,0; 3 -1.25,-0.95; 4 1.25,-0.95; 5 1.25,0.95
BGA121C80P11X11_1000X1000X120 = smd 0.29 x 0.29: A1 -4,4; A2 -3.2,4; A3 -2.4,4; A4 -1.6,4; A5 -0.8,4; A6 0,4; A7 0.8,4; A8 1.6,4; A9 2.4,4; A10 3.2,4; A11 4,4; B1 -4,3.2; B2 -3.2,3.2; B3 -2.4,3.2; B4 -1.6,3.2; B5 -0.8,3.2; B6 0,3.2; B7 0.8,3.2; B8 1.6,3.2; B9 2.4,3.2; B10 3.2,3.2; B11 4,3.2; C1 -4,2.4; C2 -3.2,2.4; C3 -2.4,2.4; C4 -1.6,2.4; C5 -0.8,2.4; C6 0,2.4; C7 0.8,2.4; C8 1.6,2.4; C9 2.4,2.4; C10 3.2,2.4; C11 4,2.4; D1 -4,1.6; D2 -3.2,1.6; D3 -2.4,1.6; D4 -1.6,1.6; D5 -0.8,1.6; D6 0,1.6; D7 0.8,1.6; D8 1.6,1.6; D9 2.4,1.6; D10 3.2,1.6; D11 4,1.6; E1 -4,0.8; E2 -3.2,0.8; E3 -2.4,0.8; E4 -1.6,0.8; E5 -0.8,0.8; E6 0,0.8; E7 0.8,0.8; E8 1.6,0.8; E9 2.4,0.8; E10 3.2,0.8; E11 4,0.8; F1 -4,0; F2 -3.2,0; F3 -2.4,0; F4 -1.6,0; F5 -0.8,0; F6 0,0; F7 0.8,0; F8 1.6,0; F9 2.4,0; F10 3.2,0; F11 4,0; G1 -4,-0.8; G2 -3.2,-0.8; G3 -2.4,-0.8; G4 -1.6,-0.8; G5 -0.8,-0.8; G6 0,-0.8; G7 0.8,-0.8; G8 1.6,-0.8; G9 2.4,-0.8; G10 3.2,-0.8; G11 4,-0.8; H1 -4,-1.6; H2 -3.2,-1.6; H3 -2.4,-1.6; H4 -1.6,-1.6; H5 -0.8,-1.6; H6 0,-1.6; H7 0.8,-1.6; H8 1.6,-1.6; H9 2.4,-1.6; H10 3.2,-1.6; H11 4,-1.6; J1 -4,-2.4; J2 -3.2,-2.4; J3 -2.4,-2.4; J4 -1.6,-2.4; J5 -0.8,-2.4; J6 0,-2.4; J7 0.8,-2.4; J8 1.6,-2.4; J9 2.4,-2.4; J10 3.2,-2.4; J11 4,-2.4; K1 -4,-3.2; K2 -3.2,-3.2; K3 -2.4,-3.2; K4 -1.6,-3.2; K5 -0.8,-3.2; K6 0,-3.2; K7 0.8,-3.2; K8 1.6,-3.2; K9 2.4,-3.2; K10 3.2,-3.2; K11 4,-3.2; L1 -4,-4; L2 -3.2,-4; L3 -2.4,-4; L4 -1.6,-4; L5 -0.8,-4; L6 0,-4; L7 0.8,-4; L8 1.6,-4; L9 2.4,-4; L10 3.2,-4; L11 4,-4
QFN50P900X900X80-65N = smd 0.85 x 0.3: 1 -4.45,3.75; 2 -4.45,3.25; 3 -4.45,2.75; 4 -4.45,2.25; 5 -4.45,1.75; 6 -4.45,1.25; 7 -4.45,0.75; 8 -4.45,0.25; 9 -4.45,-0.25; 10 -4.45,-0.75; 11 -4.45,-1.25; 12 -4.45,-1.75; 13 -4.45,-2.25; 14 -4.45,-2.75; 15 -4.45,-3.25; 16 -4.45,-3.75; 33 4.45,-3.75; 34 4.45,-3.25; 35 4.45,-2.75; 36 4.45,-2.25; 37 4.45,-1.75; 38 4.45,-1.25; 39 4.45,-0.75; 40 4.45,-0.25; 41 4.45,0.25; 42 4.45,0.75; 43 4.45,1.25; 44 4.45,1.75; 45 4.45,2.25; 46 4.45,2.75; 47 4.45,3.25; 48 4.45,3.75 | smd 0.3 x 0.85: 17 -3.75,-4.45; 18 -3.25,-4.45; 19 -2.75,-4.45; 20 -2.25,-4.45; 21 -1.75,-4.45; 22 -1.25,-4.45; 23 -0.75,-4.45; 24 -0.25,-4.45; 25 0.25,-4.45; 26 0.75,-4.45; 27 1.25,-4.45; 28 1.75,-4.45; 29 2.25,-4.45; 30 2.75,-4.45; 31 3.25,-4.45; 32 3.75,-4.45; 49 3.75,4.45; 50 3.25,4.45; 51 2.75,4.45; 52 2.25,4.45; 53 1.75,4.45; 54 1.25,4.45; 55 0.75,4.45; 56 0.25,4.45; 57 -0.25,4.45; 58 -0.75,4.45; 59 -1.25,4.45; 60 -1.75,4.45; 61 -2.25,4.45; 62 -2.75,4.45; 63 -3.25,4.45; 64 -3.75,4.45 | smd 7.25 x 7.25: 65 0,0
QFN50P300X300X80-17N = smd 0.85 x 0.3: 1 -1.45,0.75; 2 -1.45,0.25; 3 -1.45,-0.25; 4 -1.45,-0.75; 9 1.45,-0.75; 10 1.45,-0.25; 11 1.45,0.25; 12 1.45,0.75 | smd 0.3 x 0.85: 5 -0.75,-1.45; 6 -0.25,-1.45; 7 0.25,-1.45; 8 0.75,-1.45; 13 0.75,1.45; 14 0.25,1.45; 15 -0.25,1.45; 16 -0.75,1.45 | smd 1.55 x 1.55: 17 0,0
SOP50P490X110-10N = smd 1.4 x 0.3: 1 -2.2,1; 2 -2.2,0.5; 3 -2.2,0; 4 -2.2,-0.5; 5 -2.2,-1; 6 2.2,-1; 7 2.2,-0.5; 8 2.2,0; 9 2.2,0.5; 10 2.2,1
CUI_UJ3-MIABH-1-SMT = smd 0.4 x 1.35: 1 0,0; 2 0.65,0; 3 1.3,0; 4 1.95,0; 5 2.6,0; 6 6.7,0; 7 7.35,0; 8 8,0; 9 8.65,0; 10 9.3,0 | smd 1.8 x 1.9: SH1 -2.7,-2.675; SH2 10.65,-2.675
BLM21AG102BH1J = smd 0.6 x 1.25: 1 -0.9,0; 2 0.9,0
MS85 = smd 4.5 x 2.25: 1 0,-3.383; 2 0,3.383
R0603 = smd 1 x 1.1: 1 -0.85,0; 2 0.85,0
EXB2HV220JV = smd 0.5 x 0.425: 1 -1.875,-0.713; 8 1.875,-0.713; 9 1.875,0.712; 10 -1.875,0.712 | smd 0.25 x 0.425: 2 -1.25,-0.713; 3 -0.75,-0.713; 4 -0.25,-0.713; 5 0.25,-0.713; 6 0.75,-0.713; 7 1.25,-0.713; 11 1.25,0.712; 12 0.75,0.712; 13 0.25,0.712; 14 -0.25,0.712; 15 -0.75,0.712; 16 -1.25,0.712
SMS-001 = smd 1.092 x 2.007: 1 0,-4.496; 2 0,4.496
FE05-2 = drill 0.914: 1 -5.08,1.27 | drill 0.914 octagon: 2 -5.08,-1.27; 3 -2.54,1.27; 4 -2.54,-1.27; 5 0,1.27; 6 0,-1.27; 7 2.54,1.27; 8 2.54,-1.27; 9 5.08,1.27; 10 5.08,-1.27
J502-ND-142-0711-821/826 = smd 4.191 x 1.778: 1 2.115,0 | smd 4.191 x 2.667: G@1 2.115,3.495; G@2 2.115,-3.495 | smd 4.191 x 2.667 bottom: G@3 2.115,3.495; G@4 2.115,-3.495
NX2520SA192MHZEXS00ACS05400 = smd 1.2 x 1: 1 -0.85,-0.65; 2 0.85,-0.65; 3 0.85,0.65; 4 -0.85,0.65

### Placement (x,y rotation side)
C1  19.2,48.4 0 top
C2  15.7,45.3 0 top
C3  14.2,30.1 270 top
C4  23.7,48.4 180 top
C5  12.7,41.7 270 top
C6  11,33.4 180 top
C7  10.4,16.4 270 top
C8  7.3,31.6 0 bottom
C9  7.2,22 0 bottom
C10  7.2,24.6 0 bottom
C11  18.3,32.8 90 top
C12  7.9,20 180 top
C13  7.9,22.2 180 top
C14  14.4,30 270 bottom
C15  14.2,34.4 270 bottom
C16  22.2,33.5 270 bottom
C17  24.4,33.5 270 bottom
C18  24.3,23.2 180 bottom
C19  12.5,1.6 0 top
C20  24.3,21.1 180 bottom
C21  22.5,15.2 90 bottom
C22  19.5,15.2 90 bottom
C23  30.6,48.4 0 top
C24  40.64,41.4 90 top
C25  49.68,41.09 180 top
C26  49.68,43.26 180 top
C27  34.7,48.4 180 top
C28  39.88,26.58 90 bottom
C29  58.47,27.91 270 bottom
C30  50.8,30.79 90 bottom
C31  50.8,34.74 270 bottom
C32  59.9,38.4 270 top
C33  59.9,27.6 90 top
C34  59,4.8 180 top
C35  57,27.6 90 top
C36  53.27,30.73 90 top
C37  50.4,3.5 0 top
C38  57,38.4 270 top
C39  50.4,6.8 0 top
C40  64.67,34.39 0 top
C41  64.16,31.55 270 top
C42  70.75,30.69 180 top
C43  58.2,9.2 90 top
C44  65.5,21.6 0 top
C45  69.5,21.6 180 top
C46  69.5,12.6 180 top
C47  65.5,12.6 0 top
C48  64.1,3 90 top
C49  67.46,3.87 180 top
C50  70.7,2.9 90 top
C51  51.48,13.6 270 top
C53  54.5,19.1 0 top
C54  14.8,11.1 0 top
C55  14.8,9 0 top
C56  17.9,9.9 90 top
C57  26.6,16.5 90 top
C58  20.7,18.6 0 bottom
C59  10.4,35.8 0 top
C60  18.72,21.24 270 bottom
C61  27,11.2 180 top
C62  58.26,15.67 90 top
D1  6.7,17 270 top
D2  10.6,25.7 0 top
IC1  22.3,41 270 top
IC2  15.8,41.7 270 top
IC3  19.05,22.35 90 top
IC4  33.7,41 270 top
IC5  44.45,34.29 180 top
IC6  58.58,32.93 270 top
IC7  54.7,10.3 90 top
IC8  54.5,15.6 180 top
J1  4.1,25 270 top
L1  2,10.4 90 top
L2  6.7,28.6 270 top
L3  15.8,37.3 180 top
L4  12,16.4 90 top
L5  7.3,29.9 180 bottom
L6  7.2,20.4 180 bottom
L7  7.3,27.5 180 bottom
L8  58.5,38.3 270 top
L9  58.5,27.7 90 top
L10  67.5,26.1 270 top
L11  67.5,17.1 90 top
L12  66.7,8.1 270 top
R1  11.6,18.2 90 bottom
R2  32.5,10 270 top
R3  11.2,26.4 270 bottom
R4  26.6,6.3 0 top
R5  16.3,14.5 90 top
R6  21.4,11.1 270 top
R7  23.7,11.1 270 top
R8  11.1,4.7 90 top
R9  33.1,19 180 top
R10  45.21,41.15 180 top
R11  45.22,43.32 180 top
R12  32.9,33.4 180 top
R13  46.34,22.68 180 top
R14  46.34,25 180 top
R15  49.6,22.68 0 top
R16  49.6,25 0 top
R17  53.65,33.51 0 top
R18  53.65,35.68 0 top
R19  68.12,34.39 180 top
R20  67.3,30.69 180 top
R21  54.5,21.5 0 top
R22  18,14 90 bottom
R23  49.89,13.6 270 top
R24  26.6,3.5 0 top
R25  35,10 270 top
R26  73.91,14.99 180 top
R27  73.91,12.66 0 top
R28  73.91,17.31 180 top
RN1  33.02,29.21 270 top
RN2  33.02,23.14 270 top
S1  18.3,3.8 270 top
SV1  35,5 180 top
X1  80,15 180 top
Y1  10.8,29.8 90 top
Y2  54.7,4.1 180 top

### Tracks (layer width: path | path; a pad name or v marks a point on that pad's centre or on a via)
+1V2  (via drill 0.35, 0.5)
  Top 0.203: IC3.B10 15.85,25.56 15.45,25.96 14.41,25.96 14.1,26.27 v14.1,26.8 | IC3.L5 24.79,21.55 25.24,21.1 v26.4,21.1 | IC3.E9 18.65,25.15 18.65,25.95 IC3.F11 19.05,28.39 v18.95,28.5 | IC3.C3 17.05,19.55 17.05,16.75 v17.7,16.1 | v21.81,28.89 21.45,28.54 IC3.J11 | v26.2,23.3 26.05,23.15 IC3.L7 | IC3.H1 20.65,17.15 20.85,16.95 v20.85,16.05
  Top 0.61: L3.2 v14.9,39 14.9,40.4 IC2.4 13.1,40.45 C5.2 | L4.1 v13.1,15.5
  Route15 0.61: v14.9,39 14.9,35.4 v13,33.5 12.2,32.7 12.2,27.5 | 13.21,19 13.21,23.99 12.2,25 12.2,26.3 | 13.21,19 13.21,17.29 14.05,16.45 | 12.2,27.5 12.2,26.3 | 13.21,19 5.8,19 v5.3,19.5 | 14.05,16.45 14.4,16.1 v17.7,16.1 20.8,16.1 v20.85,16.05 20.85,16.45 25.5,21.1 v26.4,21.1 | 14.05,16.45 v13.1,15.5 | 12.2,27.5 5.7,27.5 v5.6,27.6 | v14.1,26.8 14.1,26.3 | 14.1,26.3 12.2,26.3 | 14.1,26.3 16.75,26.3 v18.95,28.5 19.34,28.89 v21.81,28.89
  Bottom 0.61: C17.2 C16.2 22.2,29.29 v21.81,28.89 | L5.1 6.4,27.6 | 6.4,27.6 L7.1 | 6.4,27.6 v5.6,27.6 | v14.1,26.8 14.4,27.1 C14.2 | v26.4,21.1 C20.2 C18.2 25.25,23.3 v26.2,23.3 | C22.2 v20.85,16.05 C21.2 | v13,33.5 13.05,33.55 C15.2 | L6.1 6.2,20.4 v5.3,19.5
+3V3  (via drill 0.35, 0.5)
  Top 0.203: IC3.E3 18.65,19.55 v18.65,18.75 IC3.F1 19.05,12.35 v18.6,11.9 | v21.46,30.24 20.65,29.44 IC3.H11 | v16.3,27.4 16.65,27.05 IC3.C11 | IC3.B1 15.85,18.05 v15.4,17.6 | IC3.L9 27.86,24.75 v27.97,24.64
  Top 0.305: v18.6,11.9 17.9,11.2 C56.2
  Top 0.61: IC1.4 IC1.2 22.3,47.85 C4.2 v21.6,48.4 | R8.2 13.15,5.55 15.65,8.05 C55.2 C54.2 17.55,11.1 C56.2 | C61.2 25.2,10.25 R7.2 v22.55,10.25 | v24,17.6 24.25,17.35 C57.2 | C59.2 11.25,37.55 v11.3,37.6 | R6.2 v22.55,10.25 | v22.55,10.25 v22.56,10.26
  Bottom 0.61: C60.2 18.72,18.82 v18.65,18.75 18.8,18.6 C58.2
  other vias: 19.9,35.8 20.7,35.8 21.5,35.8 22.3,35.8 23.1,35.8 23.9,35.8 24.7,35.8 24.7,36.6 23.9,36.6 23.1,36.6 22.3,36.6 21.5,36.6 20.7,36.6 19.9,36.6 19.9,37.4 20.7,37.4 21.5,37.4 22.3,37.4 23.1,37.4 23.9,37.4 24.7,37.4 24.7,38.2 23.9,38.2 23.1,38.2 22.3,38.2 21.5,38.2 20.7,38.2 19.9,38.2 19.9,39 20.7,39 21.5,39 22.3,39 23.1,39 23.9,39 24.7,39 24.7,39.8 23.9,39.8 23.1,39.8 22.3,39.8 21.5,39.8 20.7,39.8 19.9,39.8 20.7,40.6 21.5,40.6 22.3,40.6 23.1,40.6 23.9,40.6 24.7,40.6
  pour Route15 (isolate 0.61): -5,56 -5,-6 28.27,-6 28.27,56
+3V3_ADC  (via drill 0.35, 0.5)
  Top 0.305: C25.2 48.53,41.09 48.2,40.76 IC5.17 IC5.16 IC5.15 | IC5.6 48.9,32.77 | 48.9,32.77 IC5.5 | 48.9,32.77 v50.8,32.77 | IC5.32 40.7,40.49 C24.1 | IC5.49 40.28,29.42 v40.28,28.86 | IC7.7 55.2,11.1 56.25,10.05 C43.2 | IC5.1 49.9,29.54 v49.9,28.5 | C39.2 52.4,6.8 IC7.1
  Top 0.406: L8.1 v58.48,40.08
  Top 0.61: IC8.1 58.08,14.65 | 58.08,14.65 C62.1 | IC4.4 35.79,40.49 40.7,40.49 | C25.2 C26.2 48.83,45.17 v48.8,45.2 | C43.2 v58.2,12.6 58.2,14.53 58.08,14.65 | C39.2 v51.25,7.78 | R13.2 45.49,21.21 46.2,20.5 v46.6,20.5 49.8,20.5 50.45,21.15 R15.2 | L9.1 58.5,26.1 v58.4,26 | v32.7,48.4 C27.2 33.7,48.25 IC4.2 IC4.4 | IC4.4 v33.7,38.2
  Bottom 0.305: C31.2 v50.8,32.77 C30.2 | v40.28,28.86 39.88,28.46 C28.2
  Bottom 0.61: C29.2 58.47,26.07 v58.4,26
  other vias: 32.9,35.8 33.7,35.8 34.5,35.8 35.3,35.8 36.1,35.8 36.1,36.6 35.3,36.6 34.5,36.6 33.7,36.6 32.9,36.6 32.9,37.4 33.7,37.4 34.5,37.4 35.3,37.4 36.1,37.4 36.1,38.2 35.3,38.2 34.5,38.2 32.9,38.2 36.1,39 35.3,39 34.5,39 33.7,39 32.9,39 32.9,39.8 33.7,39.8 34.5,39.8 35.3,39.8 36.1,39.8 36.1,40.6 35.3,40.6 34.5,40.6 33.7,40.6 32.9,40.6
  pour Route15 (isolate 0.61): 29.09,56 83.86,56 83.86,-6 29.09,-6
ADC_ENC_N  (via drill 0.35)
  Top 0.305: IC5.12 50.01,36.04 51.83,37.86 v55.12,37.86 | IC8.3 55.35,16.95 55.35,19 | 55.35,19 C53.2 | 55.35,19 55.5,19.15 55.5,21.5 | R21.2 55.5,21.5 | v55.12,24.64 55.5,24.26 55.5,21.5
  Bottom 0.305: v55.12,37.86 v55.12,24.64
ADC_ENC_P  (via drill 0.35)
  Top 0.305: IC5.13 49.65,36.54 51.53,38.42 v54.48,38.42 | IC8.4 53.65,16.95 C53.1 R21.1 53.65,24.58 v53.59,24.64
  Bottom 0.305: v54.48,38.42 54.48,25.53 v53.59,24.64
ADC_P0
  Top 0.203: RN1.1 28.11,31.09 27.7,31.5 19.89,31.5 19.45,31.06 19.45,25.95 IC3.F10
ADC_P1  (via drill 0.3, 0.35)
  Top 0.203: IC3.F9 v19.45,25.15 | v30.4,30.5 30.44,30.46 RN1.2
  Bottom 0.203: v19.45,25.15 21.1,26.8 22.5,26.8 26.2,30.5 v30.4,30.5
ADC_P2  (via drill 0.3, 0.35)
  Top 0.203: IC3.F7 v19.45,23.55 | RN1.3 32.86,29.96 33,30.1 33,31.4 32.4,32 v30.9,32
  Bottom 0.203: v30.9,32 25.9,32 21.7,27.8 20.95,27.8 18.64,25.49 18.64,24.36 v19.45,23.55
ADC_P3
  Top 0.203: RN1.4 28.84,29.46 27.55,30.75 21.25,30.75 20.25,29.75 20.25,25.95 IC3.G10
ADC_P4  (via drill 0.3, 0.35)
  Top 0.203: IC3.G9 v20.25,25.15 | RN1.5 v30.9,28.95
  Bottom 0.203: v20.25,25.15 21.4,26.3 22.9,26.3 25.8,29.2 30.65,29.2 v30.9,28.95
ADC_P5  (via drill 0.3, 0.35)
  Top 0.203: IC3.F8 v19.45,24.35 | RN1.6 32.3,28.45 30.15,28.45 v29.9,28.7
  Bottom 0.203: v19.45,24.35 18.97,24.83 18.97,25.35 20.92,27.3 22.1,27.3 25.8,31 30.61,31 31.55,30.06 31.55,28.74 31.27,28.45 30.15,28.45 v29.9,28.7
ADC_P6
  Top 0.203: RN1.7 29.43,27.96 27.99,29.4 21.6,29.4 21.05,28.85 21.05,25.95 IC3.H10
ADC_P7  (via drill 0.3, 0.35)
  Top 0.203: IC3.H9 v21.05,25.15 | v30.4,27.3 30.43,27.34 RN1.8
  Bottom 0.203: v21.05,25.15 21.7,25.8 25.5,25.8 27,27.3 v30.4,27.3
ADC_P8
  Top 0.203: RN2.1 31.69,25.01 28.87,27.83 22.46,27.83 21.85,27.22 21.85,25.95 IC3.J10
ADC_P9  (via drill 0.3, 0.35)
  Top 0.203: IC3.J9 v21.85,25.15 | RN2.2 31.31,24.39 30.8,24.9 v30.8,25
  Bottom 0.203: v30.8,25 30.65,25.15 v21.85,25.15
ADC_P10
  Top 0.203: RN2.3 31.11,23.89 28.09,26.91 22.8,26.91 IC3.K11
ADC_P11
  Top 0.203: RN2.4 30.91,23.39 28.75,25.55 IC3.L10
ADC_P12
  Top 0.203: RN2.5 30.71,22.89 28.45,25.15 22.65,25.15 IC3.K10
ADC_P13
  Top 0.203: RN2.6 29.51,22.39 27.55,24.35 22.65,24.35 IC3.K9
ADC_P14
  Top 0.203: RN2.7 29.31,21.89 27.39,23.8 24.36,23.8 24.13,23.58 21.82,23.58 IC3.J8
ADC_P15  (via drill 0.3, 0.35)
  Top 0.203: IC3.G8 v20.25,24.35 | v30.4,21.3 30.44,21.26 RN2.8
  Bottom 0.203: v20.25,24.35 26.85,24.35 29.9,21.3 v30.4,21.3
AVDD_A7  (via drill 0.35)
  Top 0.203: IC3.A7 11.65,23.15 11.05,23.15 v10.8,23.4
  Bottom 0.203: v10.8,23.4 9.8,24.4 9.8,28.3 L5.2 | 8.2,31.55 C8.1
  Bottom 0.61: L5.2 8.2,31.55
CVDDQ_B6  (via drill 0.35)
  Top 0.203: IC3.B6 15.45,22.75 10.35,22.75 v10,23.1
  Bottom 0.203: v10,23.1 8.5,24.6 C10.1 8.2,24.75 L7.2
FX3_PMODE0
  Top 0.203: IC3.G4 20.25,20.35 20.25,13.1 R6.1
FX3_PMODE1
  Top 0.203: IC3.H4 21.05,20.35 21.05,18 21.36,17.69 21.36,14.36 23.7,12.01 R7.1
FX3_RESET  (via drill 0.3, 0.35)
  Top 0.203: IC3.C5 v16.25,21.95
  Top 0.305: v14.1,5.2 13.8,4.9 S1.1
  Top 0.61: C19.2 13.35,3.35 S1.1 13.75,3.85 R8.1
  Bottom 0.305: v16.25,21.95 16.25,7.35 v14.1,5.2
GND  (via drill 0.3, 0.35)
  Top 0.203: IC3.A8 13.27,23.95 12.75,23.95 v12.5,23.7 | IC3.A8 IC3.B8 | IC3.L6 26.07,22.35 26.76,22.35 v27.06,22.06 | IC3.A8 IC3.B9 v15.45,25.15 | IC3.K4 IC3.K3 IC3.L3 IC3.L2 IC3.L1 23.05,17.22 24.62,15.65 C57.1 | IC3.E2 17.85,18.75 17.85,17.55 v18,17.4 | v20.1,31 19.85,30.75 IC3.G11 | v20,12.2 19.85,12.35 IC3.G1 | IC3.D8 17.85,23.55 v17.85,22.75 | J1.8 v2.7,17 | IC3.A1 14.05,18.35 v14,18.3 | J1.5 v2.6,22.4 | Y2.2 53.85,5.95 v54.3,6.4 | IC3.L11 24.15,26.35 v24.2,26.4 | IC3.B7 v15.45,23.55 IC3.A8 | v15.3,27.37 15.46,27.37 16.25,26.58 v16.25,25.15
  Top 0.305: IC5.65 41.2,37.54 IC5.31 41.2,39.4 41.9,40.1 41.9,41.8 41.45,42.25 C24.2 | IC5.18 47.7,37.54 IC5.65 | IC5.14 47.2,37.04 IC5.65 | IC5.11 48.9,35.3 | 48.9,35.3 IC5.10 | 48.9,35.3 45.46,35.3 IC5.65 | IC5.7 45.2,33.54 IC5.65 | IC5.4 46.7,32.04 | IC5.2 47.7,31.04 IC5.65 | IC5.61 46.7,32.04 | 46.7,32.04 IC5.65 | IC5.50 41.2,31.04 IC5.65 | IC6.4 57.83,33.95 57.84,33.95 57.84,33.68 IC6.17 | IC6.9 57.83,31.91 57.84,31.91 57.84,32.18 IC6.17 | IC6.11 58.83,32.68 IC6.17 | IC6.12 59.33,31.91 59.33,32.18 IC6.17 | IC2.2 15.8,43.8 14.85,44.75 C2.1 | J1.8 D1.3 D1.8 | IC7.8 54.7,15.26 55.04,15.6 IC8.2
  Top 0.406: IC8.2 56.9,15.6 57.82,16.52 C62.2
  Bottom 0.305: C60.1 18.51,22.09 v17.85,22.75 23,22.75 C18.1 C20.1
  other vias: 38.9,43.3 38.9,42.4 61,40.6 62,40.6 56.1,40.4 40.6,48.5 38.2,46 39.1,46.2 41.6,48.5 51.6,23.6 51.7,24.5 51.6,22.6 60.2,24.7 60.2,23.8 60.2,22.9 63.3,20.2 62.5,20.2 61.6,20.2 57.4,17.8 58.3,17.8 59.2,17.8 57.4,18.7 58.3,18.7 59.2,18.7 73.4,31.4 73.4,30.6 73.4,29.7 70.6,35.4 70.6,34.5 70.6,33.6 62.9,40.6 72.6,20.4 73.5,20.4 74.4,20.4 75.3,20.4 73.7,9.5 74.6,9.5 75.5,9.5 70.1,0.9 71,0.9 71.9,0.9 63.2,0.8 64.1,0.8 65,0.8 61.2,5.8 61.2,5 61.2,4.2 57.3,7.1 58.2,7.1 59.1,7.1 48.3,5.5 48.3,4.7 47.4,5.5 47.4,4.7 22.7,1.9 23.6,1.9 22.7,1 23.6,1 9.2,2.9 8.3,2.9 9.4,7.5 8.6,7.5 9.4,6.7 8.6,6.7 14.9,15 17.1,12.3 14.9,13.6 11.8,9.3 11.8,10.1 11.8,10.9 12.6,10.9 12.6,10.1 12.6,9.3 8.3,39.4 7.4,39.4 7.4,40.2 8.3,40.2 9.2,40.2 9.2,39.4 12.5,47.6 11.6,47.6 10.7,47.6 10.7,46.7 11.6,46.7 12.5,46.7 12.5,45.8 11.6,45.8 10.7,45.8 59.1,30.3 59.9,30.3 60.7,30.3 57.7,30.3 56.9,30.3 56.1,30.3 61.3,31.5 61.3,34.3 56.6,35.6 55.8,35.6 56.2,36.4 43.4,21.4 43.5,23.4 41.6,21.4 13.1,7.1 15.7,5.5 17.4,6.2 18.4,6.2 27,9.5 27.8,9.5 19.27,33.47 16.79,34.64 13.01,30.61 13.01,29.8 26.4,14.4 70.71,11.11 27.3,49 27.3,48.1 46.2,48 47.9,48.3 50.3,47.3 54.3,47.2 52.4,48.4 52.6,46.7 54.9,45.9 56.1,46.9 57,47.9 55.3,48.4 54,48.5 50.2,48.5 52.9,45.2 56.4,44.3 57.7,45.5 58.7,46.5 59.7,47.8 61.2,47.4 61.1,46.2 59.8,45.4 58.7,43.9 60.9,43.8 61.7,44.7 64.3,44.1 63.4,42.7 63.6,46.3 66.4,47.4 66.2,45.7 66.7,43.8 66.1,42.3 65.7,40.5 66.5,38.9 67.4,40.6 68.7,39 69.2,40.8 68,42.8 70.7,39.5 70.5,38.1 72.2,36.8 73.7,35.4 72.5,34.7 68.2,45 68.1,46.9 64.6,48.2 62.5,48.8 58.5,48.9 56.4,42.7 61.6,42.3 40.5,18.7 43,18.5 41.5,19.7 41.4,18.1 42.6,16.4 46,13.7 47.53,15.24 40.8,14.5 43.2,13.1 41.3,12.4 38.1,10.2 37.1,9.4 36.9,10.9 37.9,11.8 37.5,13.3 36.5,12.3 36.3,14.3 37.7,14.8 37.6,16.4 52.49,11.02 34.5,15.8 31.5,15.4 31.5,17.2 34.6,17 36.5,17.2 37.8,17.8 39.5,15.8 40.4,20.1 49.4,19.2 49.91,17.54 49.08,15.46 51.33,15.62 45.8,11.2 49.84,11.61 1.7,38.1 2.8,38.8 1.6,39.8 9.18,32.62 13.26,27.52 9.04,29.95 9.2,30.85 9.22,31.75 13.02,31.42 10.51,24.61 7.47,28.7 11.7,23.67 2.8,39.87 38.4,37.4 37.6,37.4 38.4,36.6 38.4,35.8 38.4,35 38.4,38.2 50.2,38.2 50.2,39 51.1,39 51.1,39.8 50.2,39.8 46,39.8 43.5,39.8 46.1,26.4 49.6,27.2 37.6,35 37.6,35.8 37.6,36.6 37.6,38.2 37.6,39 38.4,39 38,43.3 38,42.4 38.9,41.5 43.1,41.9 42.9,42.7 45.7,37.3 46.6,37.3 46.6,36.5 45.7,36.5 45.7,35.7 46.6,35.7 46.6,34.9 45.7,34.9 45.7,34.1 46.6,34.1 46.6,33.3 45.7,33.3 45.7,32.5 46.6,32.5 46.6,31.7 45.7,31.7 43.9,37.3 43.9,36.5 43.9,35.7 43.9,34.9 43.9,34.1 43.9,33.3 43.9,32.5 43.9,31.7 41.4,37.3 41.4,36.5 41.4,35.7 41.4,34.9 41.4,34.1 41.4,33.3 41.4,32.5 41.4,31.7 41.4,30.9 43.9,30.9 45.7,30.9 46.6,30.9 50.7,27.8 50.3,26.6 51.2,27 53.6,27.3 46.4,17.2 44.8,16.1 48.38,11.08 46.1,19 42.9,20 4.78,35.35 3.98,34.65 5.03,34.19 4.19,33.59 5.44,36.81 6.61,37.48 7.6,37.2 8.3,38.2 9.2,37.5 10,38.2 58.2,33.4 59,33.4 59,32.6 58.2,32.6 27.2,14.4 44.8,37.3 44.8,36.5 44.8,35.7 44.8,34.9 44.8,34.1 44.8,33.3 44.8,32.5 44.8,31.7 44.8,30.9 43.1,37.3 43.1,36.5 43.1,35.7 43.1,34.9 43.1,34.1 43.1,33.3 43.1,32.5 43.1,31.7 43.1,30.9 42.3,30.9 42.3,31.7 42.3,32.5 42.3,33.3 42.3,34.1 42.3,34.9 42.3,35.7 42.3,36.5 42.3,37.3 5.3,22.4 24.2,14.6 23,17.3 29.1,23.6 29.6,26.2 26.2,28.5 35,26.2 27.5,33.7 24,42.7 32.5,42.7 26.5,45.7 28,41.2 29,38.7 27,36.7 18.2,44 27.65,26.22 30.5,42.7
  pour Top (isolate 0.254, no thermals): -0.73,50.46 80.73,50.46 80.73,-0.73 -0.73,-0.73
  pour Route2 (isolate 0.813): -3,54 83,54 83,-3 -3,-3
  pour Bottom (isolate 0.254, no thermals): -4,55 -4,-5 83,-5 83,55
GPIO_25
  Top 0.305: IC5.60 46.2,28.37 36.83,19 R9.1
GPIO_28
  Top 0.305: IC5.19 47.2,42.89 46.77,43.32 R11.1
GPIO_29
  Top 0.305: IC5.20 46.7,40.81 46.36,41.15 R10.1
GPIO_4351_CLK
  Top 0.61: R24.2 29.69,3.5 SV1.9
GPIO_4351_DATA
  Top 0.61: R4.2 29.89,6.3 SV1.10
GPIO_4351_LE
  Top 0.61: R2.2 32.5,6.31 SV1.8
I2C_SCL  (via drill 0.35)
  Top 0.203: v16.1,33.8 16.1,30.8 17.05,29.85 17.05,25.15 IC3.D9
  Top 0.305: IC7.4 55.2,8.85 54.46,9.58 41.73,9.58 38.82,6.68 38.82,5.01 SV1.3
  Bottom 0.203: 38.81,5 SV1.3
  Bottom 0.305: v16.1,33.8 17.05,33.8 18.4,35.15 18.4,40.78 22.65,45.03 44.15,45.03 48.34,40.85 48.34,12.02 41.31,5 38.81,5
I2C_SDA  (via drill 0.35)
  Top 0.203: v16.7,33.1 16.7,31.1 17.82,29.98 17.82,25.92 IC3.D10
  Top 0.305: IC7.5 55.7,8.96 54.64,10.02 41.29,10.02 SV1.4
  Bottom 0.305: SV1.4 47.51,16.23 47.51,40.71 44.01,44.2 22.79,44.2 19,40.41 19,34.88 17.23,33.1 v16.7,33.1
N$1
  Top 0.305: C40.1 63.81,34.38 62.98,34.38 62,33.4 60.03,33.4 | IC6.15 60.03,33.4 | 60.03,33.4 IC6.16
N$2
  Top 0.61: C49.2 66.59,3.85 C48.2 63.32,4.63 L12.1 63.32,11.27 C47.1 64.12,13.13 L11.2
N$3
  Top 0.305: IC6.13 60.03,32.4 | 60.03,32.4 IC6.14 | 60.03,32.4 61.1,32.4 C41.1
N$4
  Top 0.61: C40.2 R19.2
N$5
  Top 0.61: R20.2 66.44,30.7 C41.2 64.12,30.66 L10.1 64.12,24.68 66.35,22.45 C44.2 C45.2
N$6
  Top 0.61: R20.1 C42.2
N$7
  Top 0.305: R18.2 54.7,35.68 56.69,33.68 IC6.5
N$8
  Top 0.305: R17.2 54.89,33.51 56.22,32.18 IC6.8
N$9
  Top 0.305: R17.1 52.26,34.04 IC5.8
N$10
  Top 0.305: IC5.9 51.66,34.54 R18.1
N$11  (via drill 0.35)
  Top 0.203: IC3.K6 22.64,21.95 26.35,21.95 27.9,20.4 v27.9,16.4 | v25.8,9.4 25.8,6.35 R4.1
  Bottom 0.203: v27.9,16.4 27.9,13 25.8,10.9 v25.8,9.4
N$12
  Top 0.61: R26.2 R27.1 73.06,11.08 L12.2 70.7,7.48 C50.2 70.58,3.87 C49.1
N$13
  Top 0.61: C47.2 C46.2 68.65,13.05 70.88,15.28 L11.1 70.88,21.07 C45.1 70.88,22.13 L10.2
N$14
  Top 0.305: IC7.2 54.2,7.2 52.7,5.7 52.7,3.45
  Top 0.61: C37.2 51.3,3.45 52.7,3.45 Y2.3
N$15  (via drill 0.3, 0.35)
  Top 0.203: IC3.C6 v16.25,22.75
  Top 0.305: v11.3,32.2 10.25,32.2 10.15,32.1
  Top 0.61: C6.2 10.15,32.1 Y1.3
  Bottom 0.305: v16.25,22.75 16.95,22.75 17.7,23.5 17.7,29.3 14.8,32.2 v11.3,32.2
N$16  (via drill 0.3, 0.35)
  Top 0.203: IC3.C7 v16.25,23.55
  Top 0.305: v15.8,29.1 14.35,29.1 C3.2
  Top 0.61: C3.2 13.9,28.95 Y1.1
  Bottom 0.305: v16.25,23.55 16.65,23.55 17.1,24 17.1,27.8 v15.8,29.1
N$17
  Top 0.203: IC3.J4 21.85,20.35 21.85,15.77 24.42,13.2 30.15,13.2 R2.1
N$18
  Top 0.305: IC5.59 45.7,28.48 38.48,21.26 RN2.9
N$19
  Top 0.305: IC5.51 41.7,29.37 39.66,27.34 RN1.9
N$20
  Top 0.305: IC5.52 42.2,29.26 37.95,25.01 RN2.10
N$21
  Top 0.305: IC5.53 42.7,29.15 37.94,24.39 RN2.16
N$22
  Top 0.305: IC5.54 43.2,29.04 38.05,23.89 RN2.15
N$23
  Top 0.305: RN2.14 38.16,23.39 43.7,28.93 IC5.55
N$24
  Top 0.305: IC5.56 44.2,28.82 38.27,22.89 RN2.13
N$25
  Top 0.305: IC5.57 44.7,28.71 38.38,22.39 RN2.12
N$26
  Top 0.305: IC5.58 45.2,28.59 38.49,21.89 RN2.11
N$27
  Top 0.305: IC5.48 39.22,30.54 36.64,27.96 RN1.11
N$28
  Top 0.305: IC5.47 39,31.04 36.42,28.46 RN1.12
N$29
  Top 0.305: IC5.46 38.76,31.54 36.18,28.96 RN1.13
N$30
  Top 0.305: IC5.45 38.53,32.04 35.95,29.46 RN1.14
N$31
  Top 0.305: IC5.44 38.27,32.54 35.69,29.96 RN1.15
N$32
  Top 0.305: IC5.43 37.96,33.04 35.38,30.46 RN1.16
N$33
  Top 0.305: IC5.42 37.67,33.54 35.22,31.09 RN1.10
N$34
  Top 0.305: R13.1 R14.1 IC5.62
N$35  (via drill 0.3, 0.35)
  Top 0.203: IC3.H5 v21.05,21.95
  Top 0.305: v42.7,41.1 42.75,41.15 R10.2
  Bottom 0.305: v42.7,41.1 40.3,38.7 40.3,30.3 38.3,28.3 38.3,23.46 34.54,19.7 30.2,19.7 29.74,19.24 23.76,19.24 v21.05,21.95
N$36
  Top 0.305: IC5.63 47.7,27.1 48.75,26.05 R16.1 R15.1
N$37  (via drill 0.35)
  Top 0.203: IC3.J6 21.85,22.75 27.15,22.75 29.1,20.8 v29.59,20.8 v29.6,20.8 | v30.8,34.5 30.8,33.7 31.1,33.4 R12.2
  Bottom 0.203: v29.6,20.8 29.7,20.7 31.22,20.7 32.02,21.51 32.02,33.27 v30.8,34.5
N$38  (via drill 0.35)
  Top 0.203: IC3.J5 21.85,21.15 24.45,21.15 25.6,20 v26,20 | v42.76,43.62 43.06,43.32 R11.2
  Bottom 0.203: v42.76,43.62 39.4,40.26 39.4,30.7 37.6,28.9 37.6,24.02 33.78,20.2 26.2,20.2 v26,20
N$39  (via drill 0.3, 0.35)
  Top 0.203: IC3.G5 v20.25,21.95
  Top 0.305: v30.7,19 R9.2
  Bottom 0.305: v20.25,21.95 23.59,18.61 30.31,18.61 v30.7,19
N$40
  Top 0.61: L1.2 2,13.78 J1.SH2
  Top 1.016: J1.SH1 J1.SH2
N$42
  Top 0.406: J1.1 5.6,25 6.7,26.1 L2.2
N$43
  Top 0.305: IC7.10 53.45,12.75 C51.2
N$44
  Top 0.305: IC8.5 51.68,14.65 C51.1 R23.1
N$45  (via drill 0.3)
  Top 0.203: 17.43,20.75 IC3.D4 17.45,20.5 | v17.06,20.38 17.33,20.38 17.45,20.5 | IC3.D3 17.45,20.5
  Bottom 0.203: v17.06,20.38 17.06,15.65 17.86,14.85 R22.2
N$46
  Top 0.203: IC3.G6 19.48,21.98 19.48,9.77 R24.1
N$47
  Top 0.203: IC3.A6 11.62,22.35 9.83,22.35 9.36,22.82 9.04,22.82 8.75,22.53 C13.1
N$48
  Top 0.203: IC3.A5 11.59,21.55 10.57,21.55 9.02,20 C12.1
N$49
  Top 0.203: IC3.E6 17.85,21.95 17.85,21.35 17.65,21.15 16.25,21.15 IC3.B4 16.25,20.35 16.25,19.55 IC3.B2 16.25,18.75 16.25,15.4 R5.2
N$50  (via drill 0.3)
  Top 0.203: IC3.C8 v16.25,24.35
  Bottom 0.305: v16.25,24.35 11.65,24.35 11.2,24.8 R3.2
N$51  (via drill 0.35)
  Top 0.203: IC3.B3 15.45,20.35 11.66,20.35 v11.55,20.46
  Bottom 0.203: R1.2 11.55,19.1 v11.55,20.46
N$52
  Top 0.305: IC7.3 54.7,7 55.55,6.15 Y2.1
  Top 0.61: Y2.1 58.1,4.75 C34.2
N$53
  Top 0.203: IC3.K1 22.25,15.84 24.29,13.8 32.05,13.8 R25.1
N$54
  Top 0.61: IC2.5 16.75,37.35 L3.1
N$57
  Top 0.61: X1.1 77.87,14.99 R26.1 R28.1
PCLK
  Top 0.305: IC5.41 37.29,34.04 36.65,33.4 R12.1
PLL_LD
  Top 0.61: R25.2 SV1.6
SS_RX_N
  Top 0.203: IC3.A3 11.58,19.95 11.35,19.95 9.89,18.5 arc-90 9.53,18.5 8.94,19.08 arc90 8.57,19.08 8.49,19 arc90 8.49,18.63 9.07,18.04 arc-90 9.07,17.68 7.9,16.5 D1.7 D1.4 5.5,16.5 5.35,16.35 J1.9
SS_RX_P  (via drill 0.35)
  Top 0.203: IC3.A4 13.68,20.75 13.43,21 10.9,21 v10.8,20.9 | J1.10 5.4,15.7 5.7,16 D1.5 D1.6 8.4,16 v8.9,16.5
  Bottom 0.203: v10.8,20.9 8.9,19 v8.9,16.5
SS_TX_N
  Top 0.203: D1.10 D1.1 5.3,18 5,18.3 J1.6 4.1,20.2 6.1,22.2 C13.2
SS_TX_P
  Top 0.203: J1.7 5.05,17.65 5.2,17.5 D1.2 D1.9 7.8,17.5 8,17.7 8,18.08 6.97,19.11 6.09,19.11 5.86,19.34 5.86,19.84 6.02,20 C12.2
SSD1_N
  Top 0.203: D2.6 12.55,26.65 13.65,25.55 IC3.A10
SSD1_P
  Top 0.152: 11.96,24.62 D2.4
  Top 0.203: IC3.A9 13.17,24.75 12.71,24.29 12.29,24.29 11.96,24.62
SSD_N
  Top 0.203: J1.2 6.05,24.35 8.35,26.65 D2.1
SSD_P
  Top 0.203: J1.3 9,23.7 9.23,23.93 D2.3
U3RXV_A2
  Top 0.203: IC3.A2 12.85,19.15 12,18.3 L4.2
  Top 0.61: L4.2 11.95,17.25 C7.1
U3TXVDDQ_B5  (via drill 0.35)
  Top 0.203: IC3.B5 15.45,21.95 9.91,21.95 v9.71,21.75
  Bottom 0.305: v9.71,21.75 8.3,21.75 C9.1 8.1,21.95 L6.2
VCM  (via drill 0.35)
  Top 0.305: IC6.2 58.83,35.47 v58.96,35.6 | v55.83,30.96 55.03,30.96 54.41,31.58 C36.2 53.23,31.54 IC5.3
  Bottom 0.305: v58.96,35.6 57.57,35.6 55.83,33.86 v55.83,30.96
VPROR  (via drill 0.35)
  Top 0.305: L8.2 57.11,37.4 | L8.2 59.75,37.4 C32.2 | IC6.3 58.33,37.23 L8.2 | IC6.1 59.33,34.53 59.9,35.1 C32.2 | L9.2 58.33,28.77 IC6.10 | C35.2 57.15,28.6 L9.2 | L9.2 59.75,28.6 C33.2 60.15,28.7 v61,28.7 | C32.2 60.85,37.55 v61,37.4
  Top 0.406: 57.11,37.4 C38.2
  Bottom 0.305: v61,28.7 62.1,29.8 62.1,36.3 v61,37.4
VUSB  (via drill 0.5)
  Top 0.203: C11.1 18.25,31.9 IC3.E11
  Top 0.61: IC2.1 16.75,45.1 C2.2 19.86,45.3 IC1.3 20.05,45.19 v20.05,47.2 C1.2 | SV1.2 SV1.1 | IC2.1 16.75,42.05 16.4,41.7 15.2,41.7 14.85,42.05 IC2.3 14.85,43.35 14.5,43.7 9.6,43.7 2,36.1 2,31.3 3.8,29.5 L2.1 | C23.2 v31.45,47.2 31.45,45.19 IC4.3 | IC2.1 18.1,41.6 18.1,35.9 20,34 20,32.75 19.2,31.95 C11.1
  Route15 0.61: v31.45,47.2 31.45,35.65 33,34.1 33,12 36.5,8.5 37.85,8.5 SV1.2
  Bottom 0.61: v20.05,47.2 v31.45,47.2